# EasyEDA Pro project ProDoc_PCB6_2026-08-05.epro

# Schematic Schematic3
Assembly Variant: Basic; Board Name: PCB6; Create Date: 2026-03-05; Page Name: P1; Project Name: 电路原理图和PCB图; Schematic Name: Schematic3; Update Date: 2026-03-05; BladeWidth: 10; Company: 嘉立创EDA; Page Size: A4; RegionStart: 1; ShowBorder: 1; TitleBlock: 1; TitleBlockPosition: 3; Version: V1.0; XRegionCount: 6; YRegionCount: 4
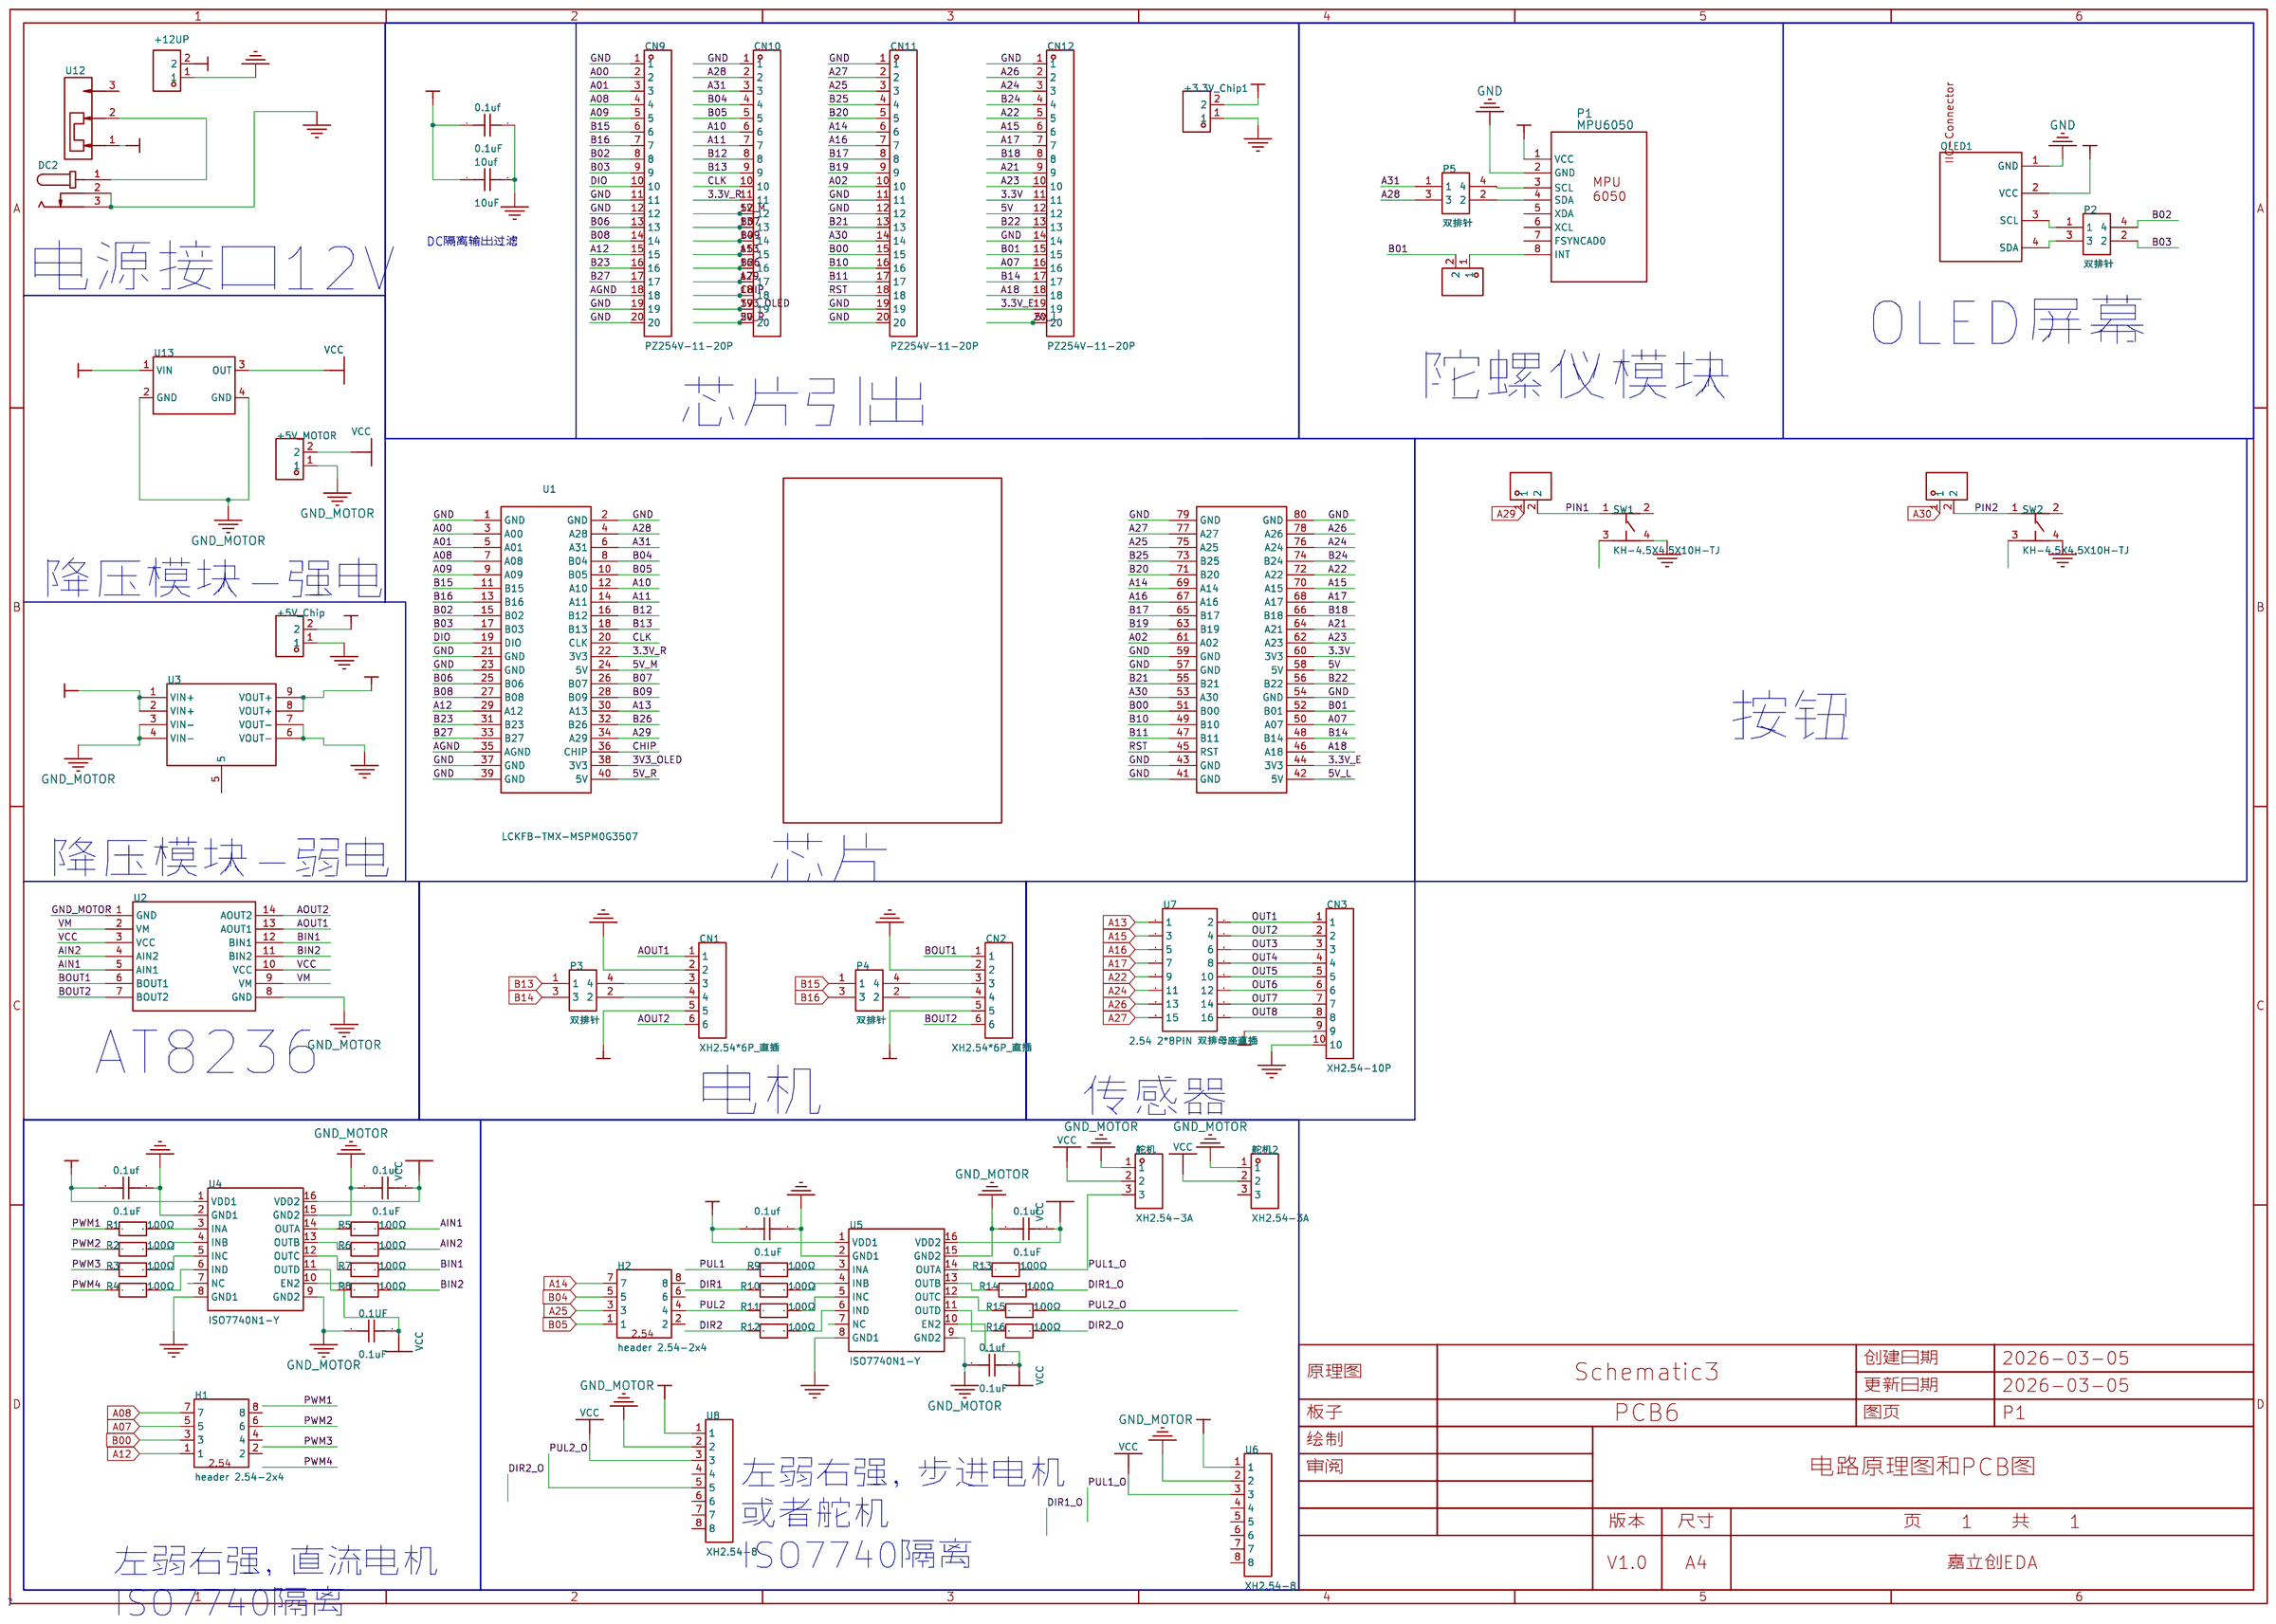
[diagram p0: schematic sheet]

## Parts
0.1uf  0.1uF  [C0805]
0.1UF  0.1uF  [C0805]
0.1uf#2  0.1uF  [C0805]
0.1uf#3  0.1uF  [C0805]
0.1uf#4  0.1uF  [C0805]
0.1uf#5  0.1uF  [C0805]
0.1uf#6  0.1uF  [C0805]
10uf  10uF  [C0805]
+3.3V_Chip1  -  [HDR-TH_2P-P2.54-V]
+5V_Chip  -  [HDR-TH_2P-P2.54-V]
+5V_MOTOR  -  [HDR-TH_2P-P2.54-V]
+12UP  -  [HDR-TH_2P-P2.54-V]
+12UP2  -  [HDR-TH_2P-P2.54-V]
CN1  XH2.54*6P_直插  [CONN-TH_XH2.54-6P]
CN2  XH2.54*6P_直插  [CONN-TH_XH2.54-6P]
CN3  XH2.54-10P  [CONN-TH_10P-P2.54_XH2.54-10P]
CN9  PZ254V-11-20P  [HDR-TH_20P-P2.54-V-M-4]
CN10  PZ254V-11-20P  [HDR-TH_20P-P2.54-V-M-4]
CN11  PZ254V-11-20P  [HDR-TH_20P-P2.54-V-M-4]
CN12  PZ254V-11-20P  [HDR-TH_20P-P2.54-V-M-4]
DC2  -  [DC-IN-TH_KH-DC-005-2.5]
H1  header 2.54-2x4  [header 2.54-2x4]
H2  header 2.54-2x4  [header 2.54-2x4]
INT  -  [HDR-TH_2P-P2.54-V]
OLED1  -  [0.96OLED_4P]
P1  MPU6050  [MPU6050]
P2  双排针  [2*2P 2.54mm]
P3  双排针  [2*2P 2.54mm]
P4  双排针  [2*2P 2.54mm]
P5  双排针  [2*2P 2.54mm]
R1  100Ω  [R0805]
R2  100Ω  [R0805]
R3  100Ω  [R0805]
R4  100Ω  [R0805]
R5  100Ω  [R0805]
R6  100Ω  [R0805]
R7  100Ω  [R0805]
R8  100Ω  [R0805]
R9  100Ω  [R0805]
R10  100Ω  [R0805]
R11  100Ω  [R0805]
R12  100Ω  [R0805]
R13  100Ω  [R0805]
R14  100Ω  [R0805]
R15  100Ω  [R0805]
R16  100Ω  [R0805]
SW1  KH-4.5X4.5X10H-TJ  [SW-TH_4P-L4.5-W4.5-P3.00-LS5.0]
SW2  KH-4.5X4.5X10H-TJ  [SW-TH_4P-L4.5-W4.5-P3.00-LS5.0]
SW3  -  [HDR-TH_2P-P2.54-V]
U1  LCKFB-TMX-MSPM0G3507  [COMM-TH_LCKFB-TMX-MSPM0G3507]
U2  -  [AT8236]
U3  -  [XC5015]
U4  ISO7740N1-Y  [SOIC-16_L9.9-W3.9-P1.27-LS6.0-BL-1]
U5  ISO7740N1-Y  [SOIC-16_L9.9-W3.9-P1.27-LS6.0-BL-1]
U6  XH2.54-8  [CONN-TH_8P-P2.54_XH2.54_C9900012080]
U7  2.54 2*8PIN 双排母座直插  [HDR-TH_16P-P2.54-V-F-R2-C8-S2.54-1]
U8  XH2.54-8  [CONN-TH_8P-P2.54_XH2.54_C9900012080]
U12  SS-12D10-G5  [SW-TH_SS-12D10-G050]
U13  -  [MP1584模块]
舵机  XH2.54-3A  [CONN-TH_3P-P2.50_HCTL_XH-3A-L]
舵机2  XH2.54-3A  [CONN-TH_3P-P2.50_HCTL_XH-3A-L]

## Library data of the parts
0.1uf 0.1UF 0.1uf#2-0.1uf#6 10uf = 0805X5R106K350NT: 容值:10uF;精度:±10%;额定电压:35V;温度系数:X5R;; LCSC Part Name: 10uF ±10% 35V; Supplier Part: C49326680; Manufacturer: AIDE(爱迪电容); Supplier Footprint: 0805; JLCPCB Part Class: Extended Part; Datasheet: https://item.szlcsc.com/datasheet/0805X5R106K350NT/51802510.html; Supplier: LCSC; Tolerance: ±10%; Voltage Rating: 35V; Temperature Coefficient: X5R
+3.3V_Chip1 +5V_Chip +5V_MOTOR +12UP +12UP2 INT SW3 = 排针2P: 2.54 1*2P 直排针 0.8u镀金 PBT RoHS,针长3*6mm; Supplier Part: C152154; Manufacturer: Nextron(台湾正凌); Manufacturer Part: Z-211-0211-0021-001; LCSC On Sale: 1; Supplier Footprint: Through Hole,P=2.54mm; JLCPCB Part Class: Extended Part; JLCPCB Stock Number: 5280; Datasheet: https://atta.szlcsc.com/upload/public/pdf/source/20171225/C152154_15141883746031203216.pdf; Supplier: LCSC; Number of Positions: 2; Connector Type: 排针; Number of Rows: 1; Mounting Type: 通孔; Contact Type: 公形引脚; Pitch: 0.100; Contact Material: 黄铜
CN1 CN2 = XH2.54*6P_直插: Supplier Part: C9900008614; Supplier Footprint: XH2.54_6P; JLCPCB Part Class: Extended Part; Supplier: LCSC
CN3 = XH2.54-10P: Supplier Part: C9900019295; Supplier Footprint: P=2.54; JLCPCB Part Class: Extended Part; Supplier: LCSC
CN9-CN12 = PZ254V-11-20P: LCSC Part Name: 排针2.54mm间距 单排 1x20P 直插 方针; Supplier Part: C22465880; Manufacturer: XFCN(兴飞); Supplier Footprint: 插件,P=2.54mm; JLCPCB Part Class: 扩展库; Datasheet: https://atta.szlcsc.com/upload/public/pdf/source/20240617/C325FF89D0FCE13B2A10BE2D3D7E6B84.pdf; Supplier: LCSC
DC2 = KH-DC-005-2.5: 连接器类型:DC电源插座;安装方式:弯插;触点内径:-;触点外径:6.4mm;额定电流:1A;额定电压:30V;工作温度范围:-25~+70;; LCSC Part Name: DC电源插座 外径:6.4mm; Supplier Part: C2847170; Manufacturer: kinghelm(金航标); Supplier Footprint: 插件; JLCPCB Part Class: Extended Part; Datasheet: https://atta.szlcsc.com/upload/public/pdf/source/20210716/C2847170_7F0110A0BEDEE81C68B76DF87AC8DA16.pdf; Supplier: LCSC; Connector Type: DC电源插座; Mounting Style: 弯插; Outside Contact Diameter: 6.4mm; Current Rating (Max): 1A; Voltage Rating (Max): 30V; Operating Temperature Range: -25~+70
H1 H2 = header 2.54-2x4
OLED1 = 0.96OLED_4P: LCSC Part Name: 0.96OLED_4P_MODULE_JX; Supplier Part: C9900004566; Manufacturer Part: 0.96OLED_4P_MODULE_JX; Supplier Footprint: THrough hole; JLCPCB Part Class: Extended Part; Supplier: LCSC
P1 = MPU6050
P2-P5 = 2*2P 2.54mm
R1-R16 = Y16245R00000F9W: 电阻类型:-;阻值:5Ω;精度:±1%;功率:200mW;工作电压:40V;温度系数:±0.2ppm/℃;; LCSC Part Name: 5Ω ±1% 200mW; Supplier Part: C1356687; Manufacturer: VISHAY(威世); Supplier Footprint: 0805; JLCPCB Part Class: Extended Part; Datasheet: https://item.szlcsc.com/datasheet/Y16245R00000F9W/1446974.html; Supplier: LCSC; Tolerance: ±1%; Power(Watts): 200mW; Voltage-Supply(Max): 40V; Temperature Coefficient: ±0.2ppm/℃; Operating Temperature: -55℃~+150℃
SW1 SW2 = KH-4.5X4.5X10H-TJ: 电路结构:单刀单掷;按钮形状:圆形按钮;安装方式:直插;开关长度:4.5mm;开关宽度:4.5mm;开关高度:10mm;带支架:不带支架;带灯:无;; LCSC Part Name: 4.5mm*4.5mm*10mm; Supplier Part: C6915243; Manufacturer: kinghelm(金航标); Supplier Footprint: 插件-4P,4.5x4.5mm; JLCPCB Part Class: Extended Part; Datasheet: https://item.szlcsc.com/datasheet/KH-4.5X4.5X10H-TJ/7879759.html; Supplier: LCSC; Circuit: 单刀单掷; Actuator Style: 圆形按钮; Mounting Type: 直插; Length: 4.5mm; Width: 4.5mm; Switch Height: 10mm; with Bracket: 不带支架; Actuator/Cap Color: 黑色; With Lamp: 无; Termination Style: PC引脚
U1 = LCKFB-TMX-MSPM0G3507: LCSC Part Name: 5件套 立创·天猛星MSPM0G3507开发板; Supplier Part: C42378531; Manufacturer: 立创开发板; Datasheet: https://atta.szlcsc.com/upload/public/pdf/source/20241209/800332349277522348D9357AB5109808.pdf; Supplier: LCSC
U2 = AT8236
U3 = XC5015隔离模块
U4 U5 = ISO7740N1-Y: 四通道数字隔离器,电容隔离，SOP16封装; LCSC Part Name: 四通道隔离器-窄体; Supplier Part: C53446591; Manufacturer: YLPTEC(易川); Supplier Footprint: SOIC-16; JLCPCB Part Class: Extended Part; Datasheet: https://item.szlcsc.com/datasheet/ISO7740N1-Y/56597971.html; Supplier: LCSC; Number of Forward Channels: 4; Number of Reverse Channels: 0; Data Rate(Max): 150Mbps; Default Output: 高电平; Isolation Voltage(Vrms): 3750; CMTI(kV/us): 200kV/us; Voltage - Supply(VCCA): 2.5V~5.5V; Voltage - Supply(VCCB): 2.5V~5.5V; Operating Temperature: -40℃~+125℃
U6 U8 = XH2.54-8: Supplier Part: C9900012080; JLCPCB Part Class: Extended Part; Supplier: LCSC
U7 = 2.54 2*8PIN 双排母座直插: Supplier Part: C9900000696; Supplier Footprint: TH-16_5.0X20.3X2.54P; JLCPCB Part Class: Extended Part; Supplier: LCSC
U12 = SS-12D10-G5: 电路结构:单刀双掷;安装方式:直插;开关颜色:黑色;滑钮形状:矩形柱状;引脚样式:PC引脚;开关长度:12.7mm;开关宽度:6.7mm;开关高度:11.3mm;; LCSC Part Name: 插件大电流拨动开关; Supplier Part: C2998777; Manufacturer: DEALON(德艺隆); Supplier Footprint: 插件; JLCPCB Part Class: Extended Part; Datasheet: https://atta.szlcsc.com/upload/public/pdf/source/20220428/E10CB334ACBAF32CF4AF8D87DA871CD3.pdf; Supplier: LCSC; Circuit: 单刀双掷; Mounting Style: 直插; Actuator Color: 黑色; Actuator Style: 矩形柱状; Pin Style: PC引脚; Switch Length: 12.7mm; Switch Width: 6.7mm; Switch Height: 11.3mm
U13 = MP1584模块: Pin Type: IN
舵机 舵机2 = XH2.54-3A: Supplier Part: C9900018379; JLCPCB Part Class: Extended Part; Supplier: LCSC

## Nets
3.3V: 0.1uf#3.1 0.1uf#4.1 CN3.9 CN12.11 U1.60(3V3) U4.1(VDD1) U5.1(VDD1)
3.3V_E: CN1.5 CN2.5 CN12.19 P1.1(VCC) U1.44(3V3)
3.3V_R: CN10.11 U1.22(3V3)
3V3_OLED: +3.3V_Chip1.2 CN10.19 OLED1.2(VCC) U1.38(3V3)
5V: 0.1uf#6.1 10uf.1 +5V_Chip.2 CN12.12 U1.58(5V) U3.8(VOUT+) U3.9(VOUT+)
5V_L: CN12.20 U1.42(5V)
5V_M: CN10.12 U1.24(5V)
5V_R: CN10.20 U1.40(5V)
AGND: CN9.18 U1.35(AGND)
GND: 0.1uf#3.2 0.1uf#4.2 0.1uf#6.2 10uf.2 +3.3V_Chip1.1 +5V_Chip.1 CN1.2 CN2.2 CN3.10 CN9.1 CN9.11 CN9.12 CN9.19 CN9.20 CN10.1 CN11.1 CN11.11 CN11.12 CN11.19 CN11.20 CN12.1 CN12.14 OLED1.1(GND) P1.2(GND) SW1.4 SW2.4 U1.1(GND) U1.2(GND) U1.21(GND) U1.23(GND) U1.37(GND) U1.39(GND) U1.41(GND) U1.43(GND) U1.54(GND) U1.57(GND) U1.59(GND) U1.79(GND) U1.80(GND) U3.6(VOUT-) U3.7(VOUT-) U4.2(GND1) U4.8(GND1) U5.2(GND1) U5.8(GND1)
GND_MOTOR: 0.1uf.1 0.1UF.1 0.1uf#2.1 0.1uf#5.1 +5V_MOTOR.1 +12UP.1 DC2.2 DC2.3 U2.1(GND) U2.8(GND) U3.3(VIN-) U3.4(VIN-) U4.9(GND2) U4.15(GND2) U5.9(GND2) U5.15(GND2) U6.2 U8.2 U13.2(GND) U13.4(GND) 舵机.1 舵机2.1
VCC: 0.1uf.2 0.1UF.2 0.1uf#2.2 0.1uf#5.2 +5V_MOTOR.2 U2.3(VCC) U2.10(VCC) U4.10(EN2) U4.16(VDD2) U5.10(EN2) U5.16(VDD2) U6.3 U8.3 U13.3(OUT) 舵机.2 舵机2.2
A00: CN9.2 U1.3(A00)
A01: CN9.3 U1.5(A01)
A02: CN11.10 U1.61(A02)
A07: CN12.16 H1.5 U1.50(A07)
A08: CN9.4 H1.7 U1.7(A08)
A09: CN9.5 U1.9(A09)
A10: CN10.6 U1.12(A10)
A11: CN10.7 U1.14(A11)
A12: CN9.15 H1.1 U1.29(A12)
A13: CN10.15 U1.30(A13) U7.1
A14: CN11.6 H2.7 U1.69(A14)
A15: CN12.6 U1.70(A15) U7.3
A16: CN11.7 U1.67(A16) U7.5
A17: CN12.7 U1.68(A17) U7.7
A18: CN12.18 U1.46(A18)
A21: CN12.9 U1.64(A21)
A22: CN12.5 U1.72(A22) U7.9
A23: CN12.10 U1.62(A23)
A24: CN12.3 U1.76(A24) U7.11
A25: CN11.3 H2.3 U1.75(A25)
A26: CN12.2 U1.78(A26) U7.13
A27: CN11.2 U1.77(A27) U7.15
A28: CN10.2 P5.3 U1.4(A28)
A29: CN10.17 SW3.1 U1.34(A29)
A30: +12UP2.1 CN11.14 U1.53(A30)
A31: CN10.3 P5.1 U1.6(A31)
AIN1: R5.2 U2.5(AIN1)
AIN2: R6.2 U2.4(AIN2)
AOUT1: CN1.1 U2.13(AOUT1)
AOUT2: CN1.6 U2.14(AOUT2)
B00: CN11.15 H1.3 U1.51(B00)
B01: CN12.15 INT.2 U1.52(B01)
B02: CN9.8 P2.4 U1.15(B02)
B03: CN9.9 P2.2 U1.17(B03)
B04: CN10.4 H2.5 U1.8(B04)
B05: CN10.5 H2.1 U1.10(B05)
B06: CN9.13 U1.25(B06)
B07: CN10.13 U1.26(B07)
B08: CN9.14 U1.27(B08)
B09: CN10.14 U1.28(B09)
B10: CN11.16 U1.49(B10)
B11: CN11.17 U1.47(B11)
B12: CN10.8 U1.16(B12)
B13: CN10.9 P3.1 U1.18(B13)
B14: CN12.17 P3.3 U1.48(B14)
B15: CN9.6 P4.1 U1.11(B15)
B16: CN9.7 P4.3 U1.13(B16)
B17: CN11.8 U1.65(B17)
B18: CN12.8 U1.66(B18)
B19: CN11.9 U1.63(B19)
B20: CN11.5 U1.71(B20)
B21: CN11.13 U1.55(B21)
B22: CN12.13 U1.56(B22)
B23: CN9.16 U1.31(B23)
B24: CN12.4 U1.74(B24)
B25: CN11.4 U1.73(B25)
B26: CN10.16 U1.32(B26)
B27: CN9.17 U1.33(B27)
BIN1: R7.2 U2.12(BIN1)
BIN2: R8.2 U2.11(BIN2)
BOUT1: CN2.1 U2.6(BOUT1)
BOUT2: CN2.6 U2.7(BOUT2)
CHIP: CN10.18 U1.36(CHIP)
CLK: CN10.10 U1.20(CLK)
DIO: CN9.10 U1.19(DIO)
DIR1: H2.6 R10.1
DIR1_O: R14.2 U6.6
DIR2: H2.2 R12.1
DIR2_O: R16.2 U8.6
OUT1: CN3.1 U7.2
OUT2: CN3.2 U7.4
OUT3: CN3.3 U7.6
OUT4: CN3.4 U7.8
OUT5: CN3.5 U7.10
OUT6: CN3.6 U7.12
OUT7: CN3.7 U7.14
OUT8: CN3.8 U7.16
PIN1: SW1.1 SW3.2
PIN2: +12UP2.2 SW2.1
PUL1: H2.8 R9.1
PUL1_O: R13.2 U6.5 舵机.3
PUL2: H2.4 R11.1
PUL2_O: R15.2 U8.5 舵机2.3
PWM1: H1.8 R1.1
PWM2: H1.6 R2.1
PWM3: H1.4 R3.1
PWM4: H1.2 R4.1
RST: CN11.18 U1.45(RST)
VM: +12UP.2 U2.2(VM) U2.9(VM) U3.1(VIN+) U3.2(VIN+) U6.1 U8.1 U12.1 U13.1(VIN)
$1N279: R1.2 U4.3(INA)
$1N280: R2.2 U4.4(INB)
$1N281: R3.2 U4.5(INC)
$1N282: R4.2 U4.6(IND)
$1N288: R5.1 U4.14(OUTA)
$1N289: R6.1 U4.13(OUTB)
$1N290: R7.1 U4.12(OUTC)
$1N291: R8.1 U4.11(OUTD)
$1N324: DC2.1 U12.2
$1N338: R16.1 U5.11(OUTD)
$1N339: R15.1 U5.12(OUTC)
$1N340: R14.1 U5.13(OUTB)
$1N341: R13.1 U5.14(OUTA)
$1N347: R12.2 U5.6(IND)
$1N348: R11.2 U5.5(INC)
$1N349: R10.2 U5.4(INB)
$1N350: R9.2 U5.3(INA)
$1N570: OLED1.3(SCL) P2.1
$1N571: OLED1.4(SDA) P2.3
$1N572: CN1.3 P3.4
$1N573: CN1.4 P3.2
$1N574: CN2.3 P4.4
$1N575: CN2.4 P4.2
$1N583: P1.3(SCL) P5.4
$1N584: P1.4(SDA) P5.2
$1N587: INT.1 P1.8(INT)

Not connected (* = marked no-connect by the designer): P1 5(XDA) 6(XCL) 7(FSYNCAD0); SW1 2 3; SW2 2 3; U3 5; U4 7(NC); U5 7(NC); U6 4 7 8; U8 4 7 8; U12 3

## Notes on the sheet
- DC隔离输出过滤
- 电源接口12V
- OLED屏幕
- 陀螺仪模块
- 芯片引出
- 降压模块-强电
- 按钮
- 降压模块-弱电
- 芯片
- AT8236
- 电机
- 传感器
- 左弱右强，步进电机
  或者舵机
  ISO7740隔离
- 左弱右强，直流电机
  ISO7740隔离

# Board PCB6
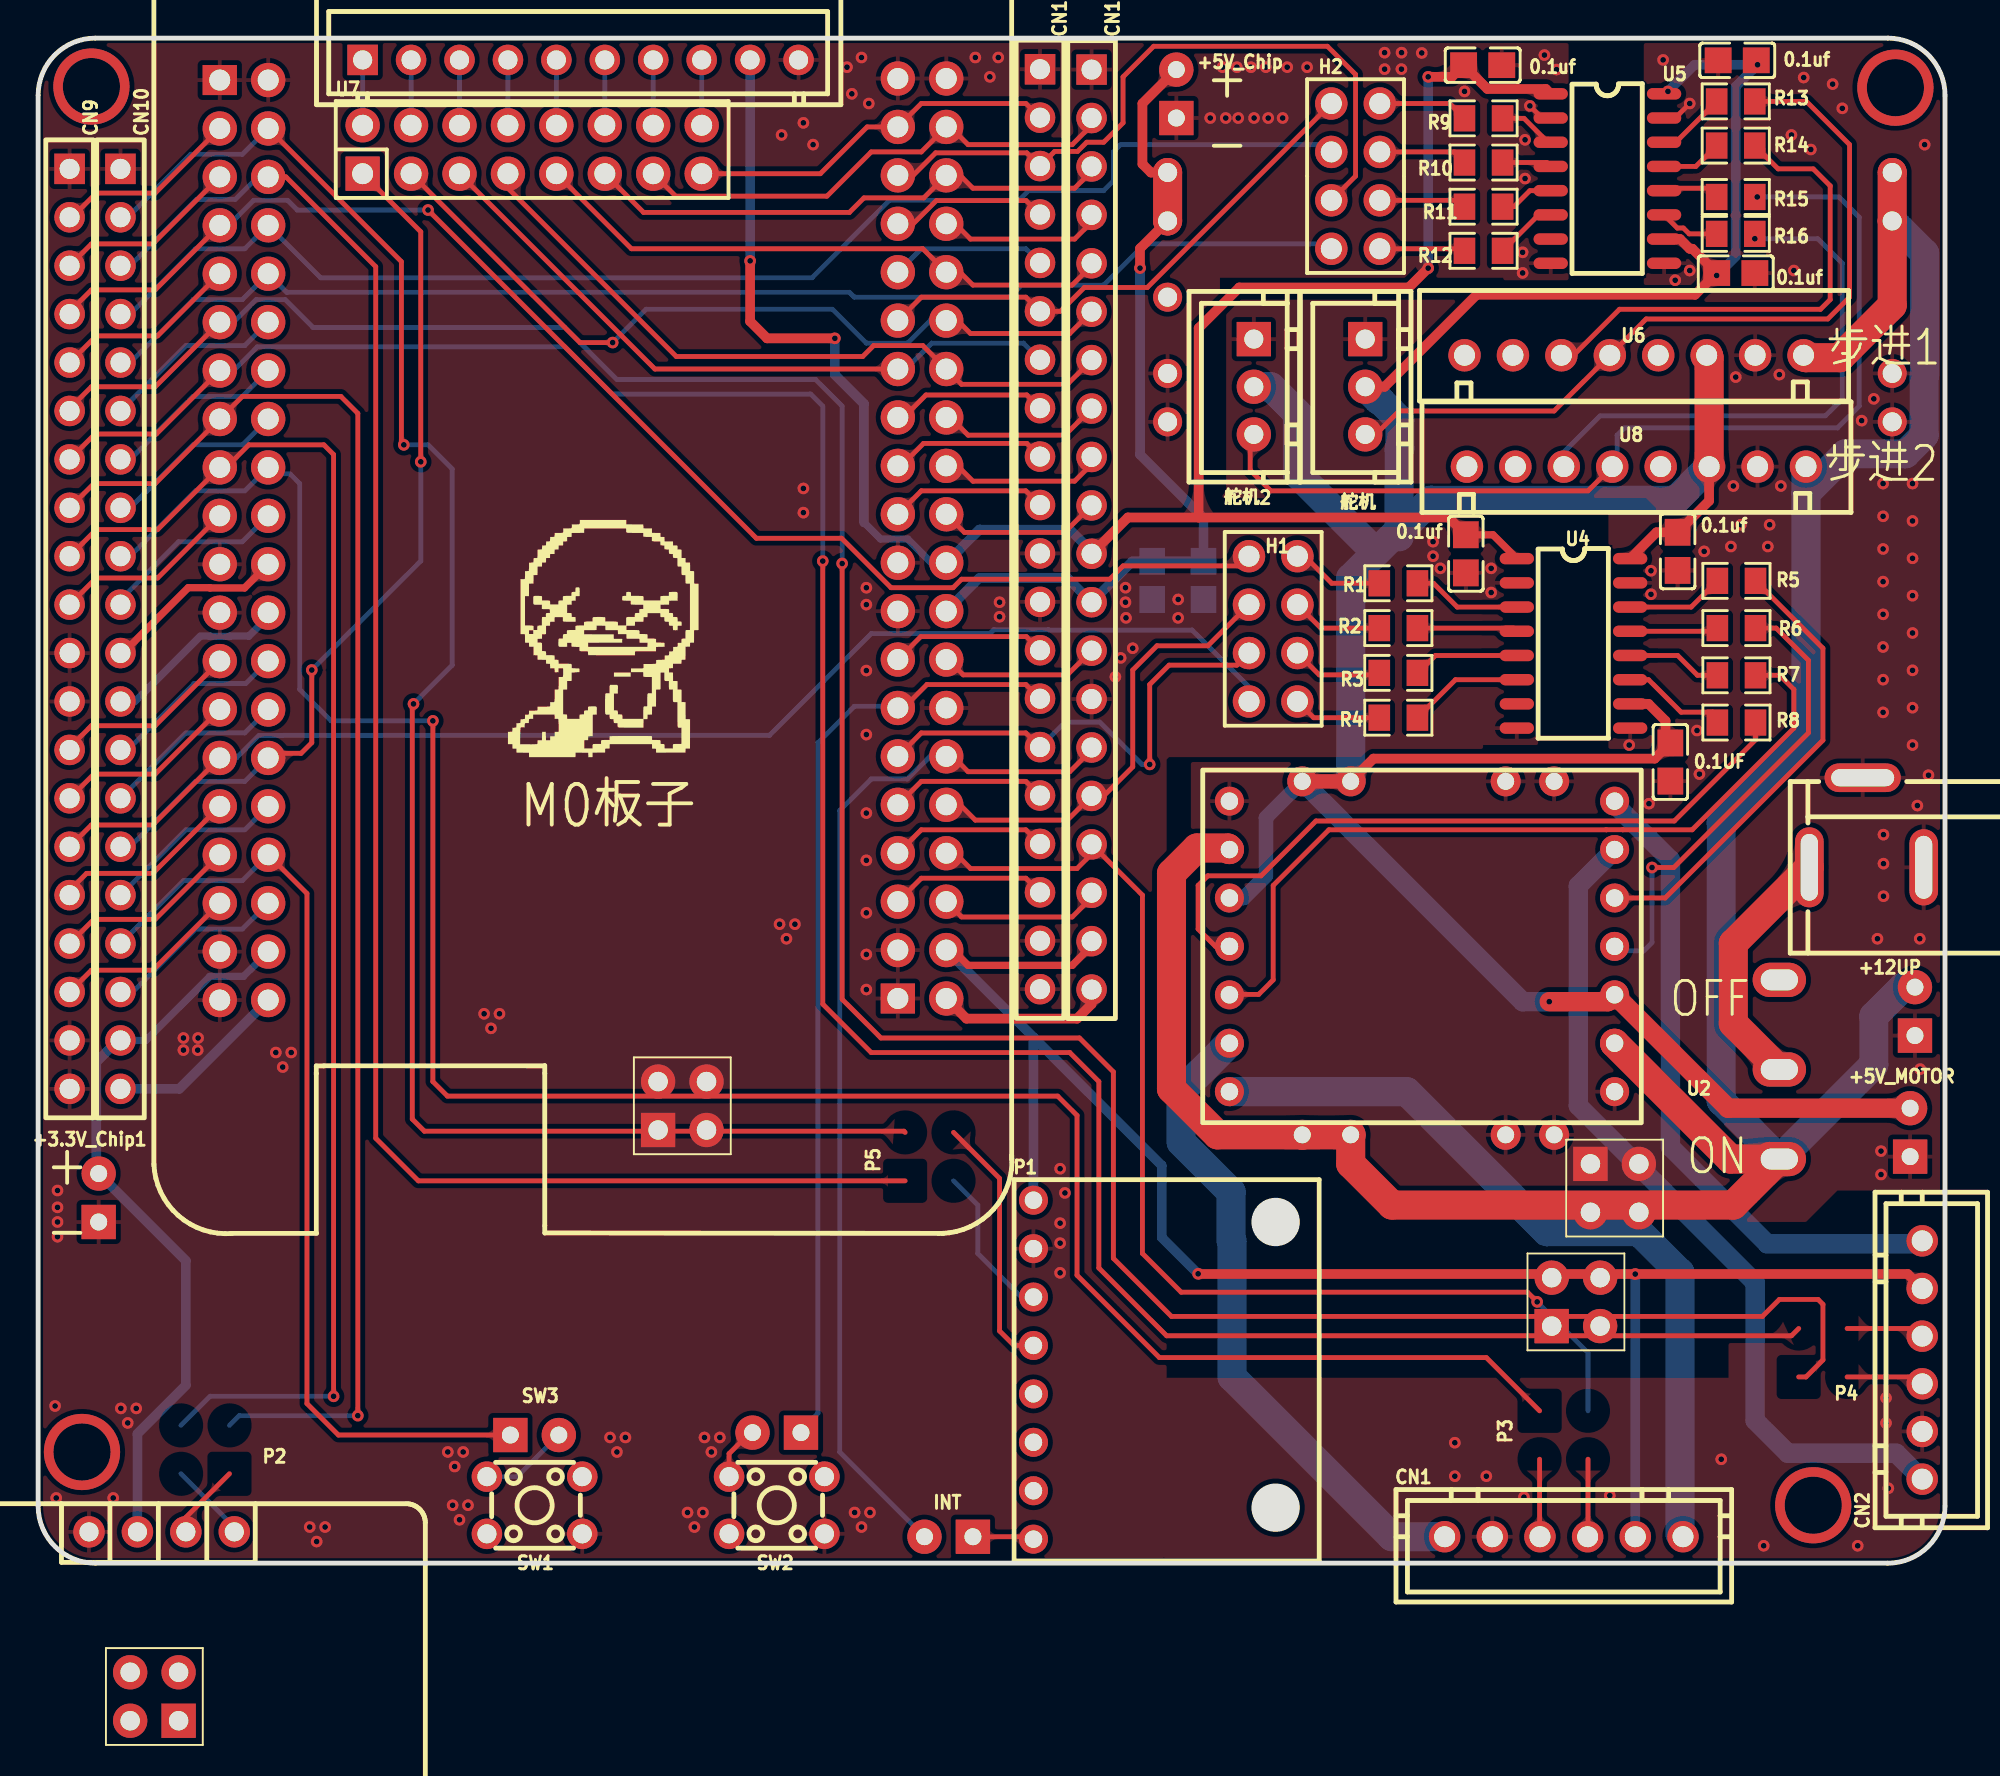
[diagram p1: board, top side]
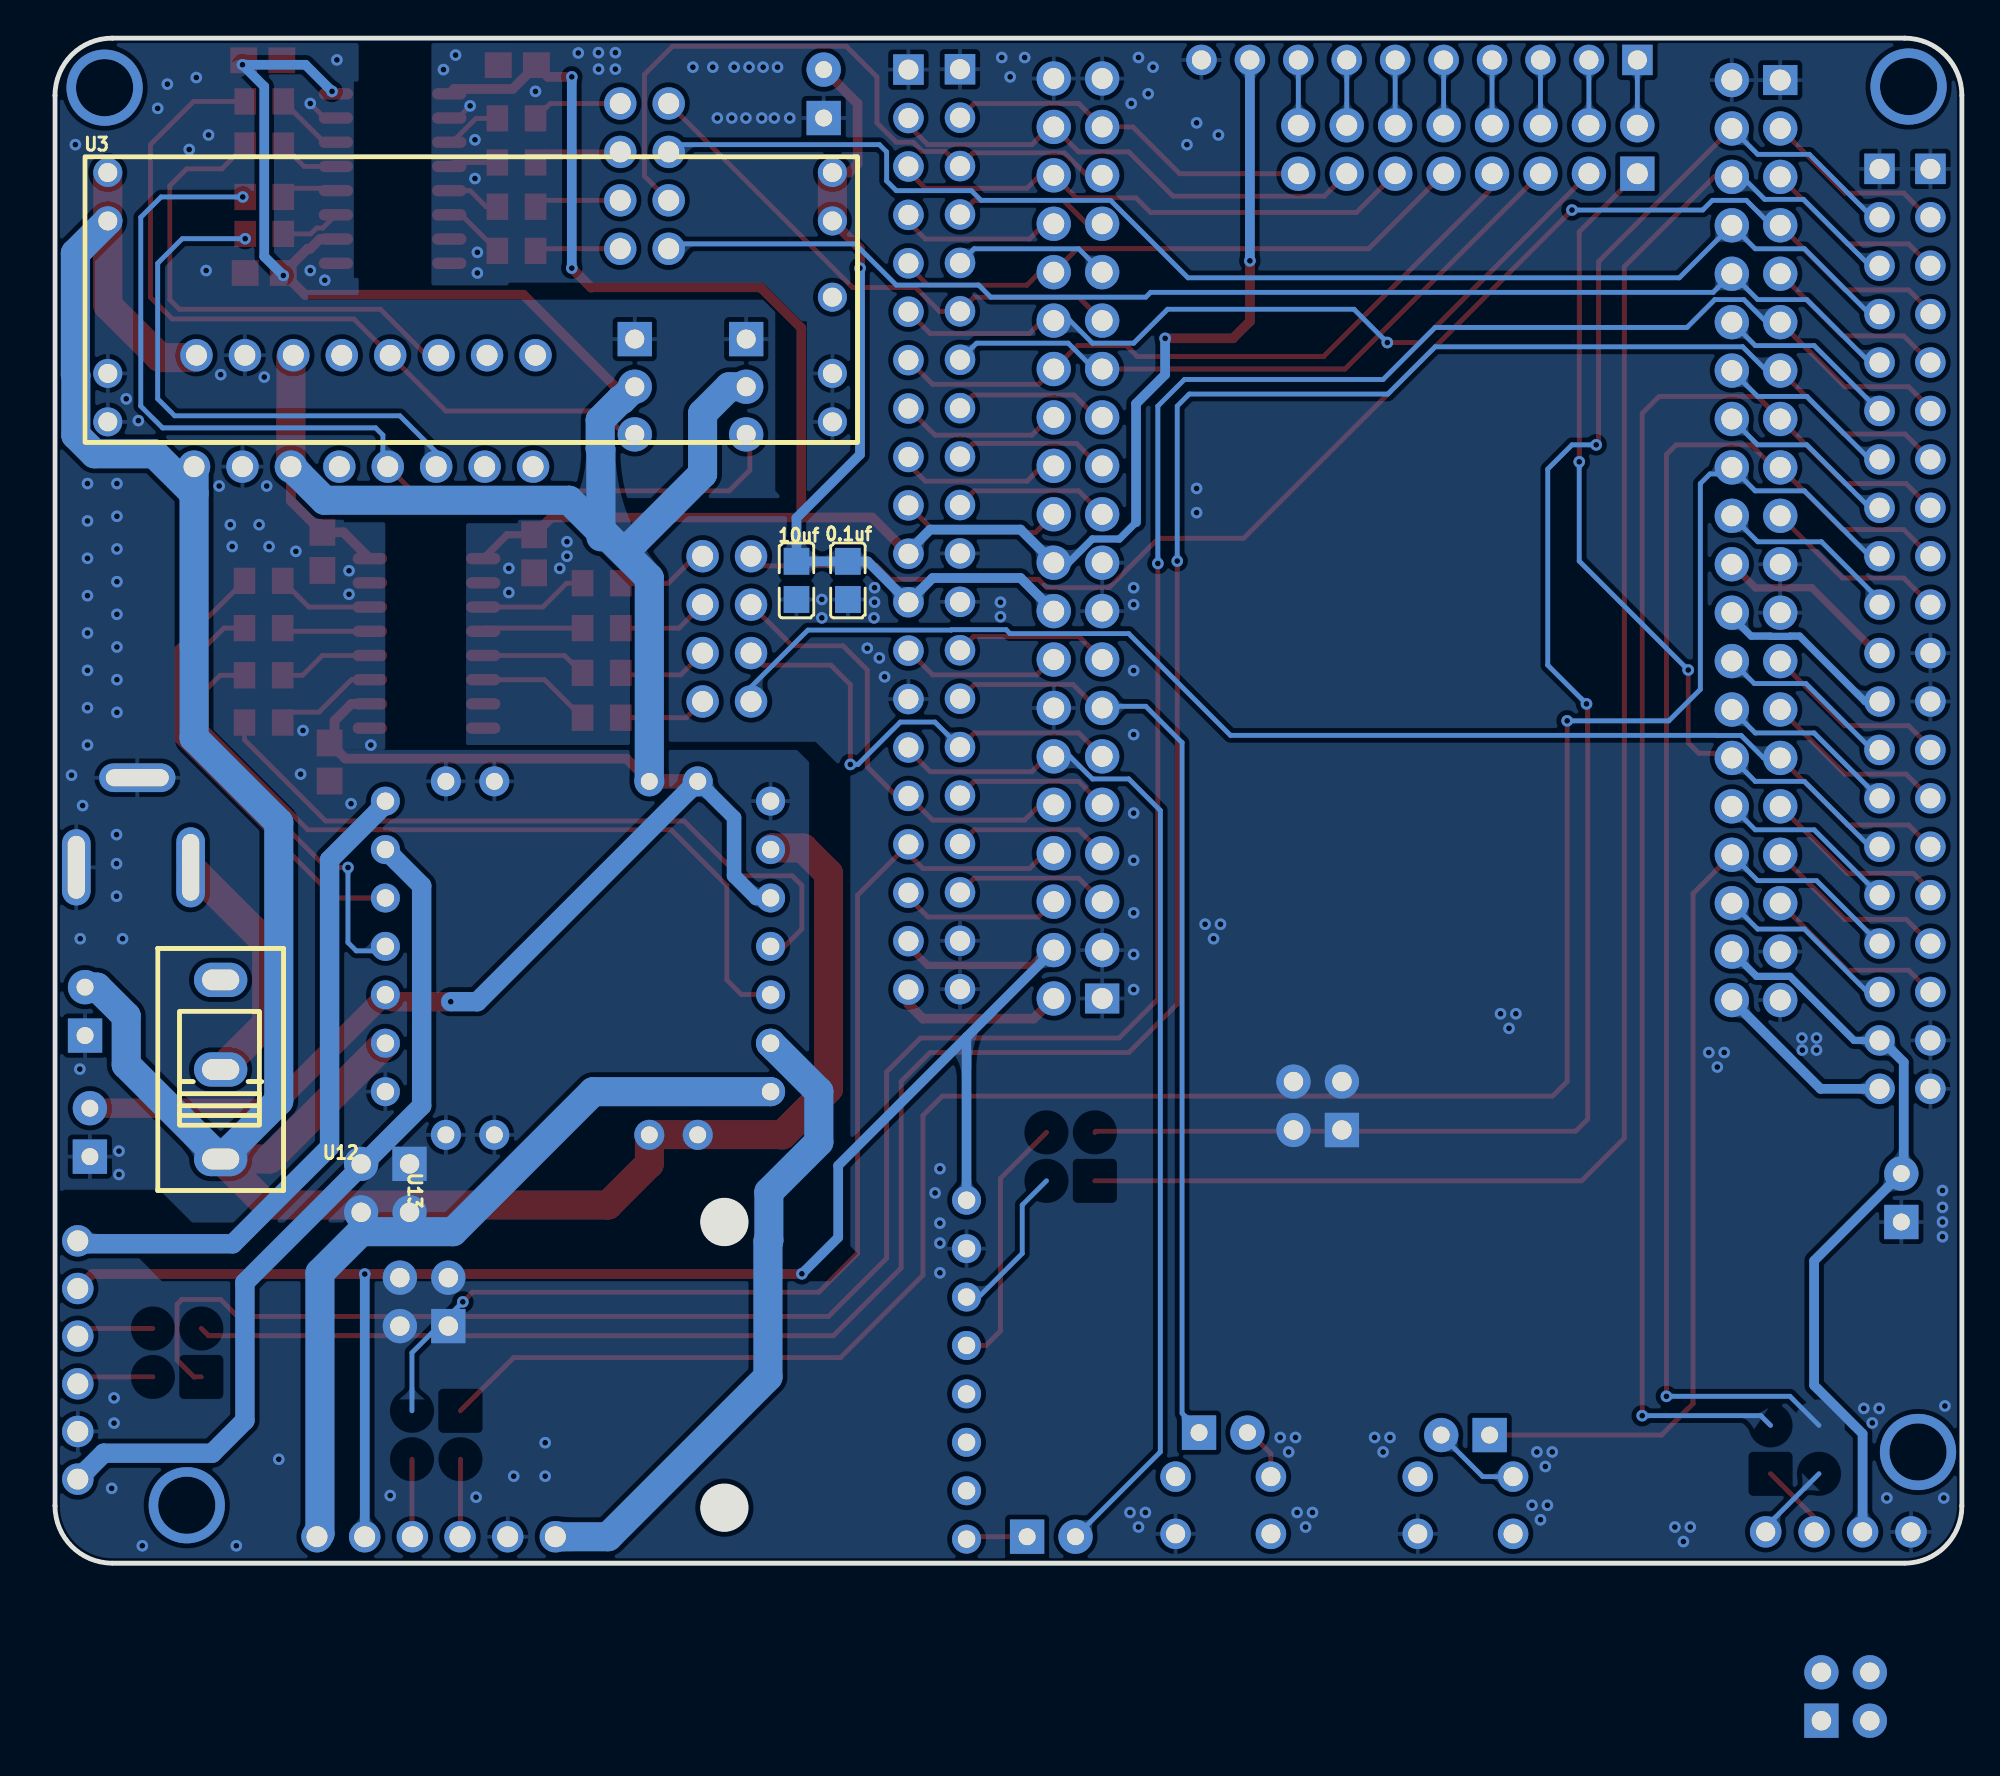
[diagram p2: board, bottom side, seen from below]

Outline 100 x 80 mm; copper layers: Top Layer, Bottom Layer. Coordinates in mm from the lower left corner of the outline.
Outline path: 0,77 0,3 arc(0.88,0.88) 3,0 97,0 arc(99.12,0.88) 100,3 100,77 arc(99.12,79.12) 97,80 3,80 arc(0.88,79.12) 0,77
Stack: Top Layer 0.035mm / Dielectric1 1.51mm FR4 er 4.5 / Bottom Layer 0.035mm

## Design rules (mm)
spacing copperThickness1oz (default): track to track 0.102, other pairs 0.152 to 0.3
spacing copperThickness2oz: track to track 0.203, other pairs 0.152 to 0.3
track width copperThickness1oz (default): min 0.127, default 0.254, max 2.54
track width copperThickness2oz: min 0.203, default 0.254, max 2.54
differential pair differentialPair (default): width min 0.127, default 0.254, max 2.54; gap min 0.152, default 0.152
net GND_MOTOR uses copperRegion
net GND uses copperRegion

## Placement (name value [footprint] x y rotation side)
0.1uf  0.1uF  [C0805]  89.1 78.84 0 top
0.1UF  0.1uF  [C0805]  85.6 42.03 90 top
0.1uf#2  0.1uF  [C0805]  75.75 78.58 0 top
0.1uf#3  0.1uF  [C0805]  85.98 53.08 90 top
0.1uf#4  0.1uF  [C0805]  74.87 52.95 270 top
0.1uf#5  0.1uF  [C0805]  89.03 67.68 180 top
0.1uf#6  0.1uF  [C0805]  58.42 51.55 270 bottom
10uf  10uF  [C0805]  61.11 51.55 270 bottom
+3.3V_Chip1  -  [HDR-TH_2P-P2.54-V]  3.17 19.17 90 top
+5V_Chip  -  [HDR-TH_2P-P2.54-V]  59.69 77.08 90 top
+5V_MOTOR  -  [HDR-TH_2P-P2.54-V]  98.17 22.6 90 top
+12UP  -  [HDR-TH_2P-P2.54-V]  98.43 28.95 90 top
+12UP2  -  [HDR-TH_2P-P2.54-V]  38.74 6.85 180 top
CN1  XH2.54*6P_直插  [CONN-TH_XH2.54-6P]  80.01 1.39 0 top
CN2  XH2.54*6P_直插  [CONN-TH_XH2.54-6P]  98.81 10.66 90 top
CN3  XH2.54-10P  [CONN-TH_10P-P2.54_XH2.54-10P]  28.45 78.86 0 top
CN9  PZ254V-11-20P  [HDR-TH_20P-P2.54-V-M-4]  1.65 49.01 270 top
CN10  PZ254V-11-20P  [HDR-TH_20P-P2.54-V-M-4]  4.32 49.01 270 top
CN11  PZ254V-11-20P  [HDR-TH_20P-P2.54-V-M-4]  52.54 54.24 270 top
CN12  PZ254V-11-20P  [HDR-TH_20P-P2.54-V-M-4]  55.25 54.22 270 top
DC2  -  [DC-IN-TH_KH-DC-005-2.5]  95.88 38.85 180 top
H1  -  [header 2.54-2x4]  63.5 45.2 0 top
H2  -  [header 2.54-2x4]  67.82 68.95 0 top
INT  -  [HDR-TH_2P-P2.54-V]  47.75 1.39 180 top
OLED1  -  [0.96OLED_4P]  6.48 1.64 0 top
P1  -  [MPU6050]  51.18 0.12 0 top
P2  双排针  [2*2P 2.54mm]  8.76 5.96 90 top
P3  双排针  [2*2P 2.54mm]  80.01 6.72 270 top
P4  双排针  [2*2P 2.54mm]  93.6 11.04 0 top
P5  双排针  [2*2P 2.54mm]  46.74 21.33 0 top
R1  100Ω  [R0805]  71.33 51.4 0 top
R2  100Ω  [R0805]  71.33 49.05 0 top
R3  100Ω  [R0805]  71.33 46.7 0 top
R4  100Ω  [R0805]  71.33 44.35 0 top
R5  100Ω  [R0805]  89.06 51.53 0 top
R6  100Ω  [R0805]  89.06 49.05 0 top
R7  100Ω  [R0805]  89.06 46.58 0 top
R8  100Ω  [R0805]  89.06 44.1 0 top
R9  100Ω  [R0805]  75.8 75.79 0 top
R10  100Ω  [R0805]  75.8 73.47 0 top
R11  100Ω  [R0805]  75.8 71.16 0 top
R12  100Ω  [R0805]  75.8 68.84 0 top
R13  100Ω  [R0805]  89.03 76.68 0 top
R14  100Ω  [R0805]  89.03 74.36 0 top
R15  100Ω  [R0805]  89.03 71.67 0 top
R16  100Ω  [R0805]  89.03 69.73 0 top
SW1  KH-4.5X4.5X10H-TJ  [SW-TH_4P-L4.5-W4.5-P3.00-LS5.0]  26.03 3.04 0 top
SW2  KH-4.5X4.5X10H-TJ  [SW-TH_4P-L4.5-W4.5-P3.00-LS5.0]  38.74 3.04 0 top
SW3  -  [HDR-TH_2P-P2.54-V]  26.03 6.72 0 top
U1  LCKFB-TMX-MSPM0G3507  [COMM-TH_LCKFB-TMX-MSPM0G3507]  28.57 53.71 0 top
U2  -  [AT8236]  84.07 23.1 180 top
U3  -  [XC5015]  78.23 66.41 180 bottom
U4  ISO7740N1-Y  [SOIC-16_L9.9-W3.9-P1.27-LS6.0-BL-1]  80.52 48.25 270 top
U5  ISO7740N1-Y  [SOIC-16_L9.9-W3.9-P1.27-LS6.0-BL-1]  82.3 72.63 270 top
U6  XH2.54-8  [CONN-TH_8P-P2.54_XH2.54_C9900012080]  83.69 63.36 180 top
U7  2.54 2*8PIN 双排母座直插  [HDR-TH_16P-P2.54-V-F-R2-C8-S2.54-1]  25.91 74.16 0 top
U8  XH2.54-8  [CONN-TH_8P-P2.54_XH2.54_C9900012080]  83.82 57.52 180 top
U12  SS-12D10-G5  [SW-TH_SS-12D10-G050]  91.31 25.9 90 bottom
U13  -  [MP1584模块]  72.9 31.74 90 bottom
舵机  XH2.54-3A  [CONN-TH_3P-P2.50_HCTL_XH-3A-L]  69.6 61.71 90 top
舵机2  XH2.54-3A  [CONN-TH_3P-P2.50_HCTL_XH-3A-L]  63.75 61.71 90 top

## Footprints (pads in the part's own frame, mm; a bottom-side part is the same pattern mirrored in y, then rotated)
0.96OLED_4P
  round 1.651 hole 1.001: 1(-3.81,0) 2(-1.27,0.003) 3(1.27,0.003) 4(3.81,0.003)
2*2P 2.54mm
  rect 1.8x1.8 hole 1.02: 1(-14.224,1.397)
  round 1.8 hole 1.02: 2(-11.684,3.937) 3(-14.224,3.937) 4(-11.684,1.397)
AT8236
  round 1.524 hole 0.914: 1(1.4,-1.63) 2(1.4,-4.17) 3(1.4,-6.71) 4(1.4,-9.25) 5(1.4,-11.79) 6(1.4,-14.33) 7(1.4,-16.87) 8(21.6,-16.87) 9(21.6,-14.33) 10(21.6,-11.79) 11(21.6,-9.25) 12(21.6,-6.71) 13(21.6,-4.17) 14(21.6,-1.63)
C0805
  rect 1.41x1.35 smd: 1(-1,0) 2(1,0)
COMM-TH_LCKFB-TMX-MSPM0G3507
  rect 1.8x1.575 hole 1.1: 1(-19.05,24.09) 41(16.51,-24.09)
  round 1.8 hole 1.1: 2(-16.51,24.09) 3(-19.05,21.549) 4(-16.51,21.549) 5(-19.05,19.009) 6(-16.51,19.009) 7(-19.05,16.47) 8(-16.51,16.47) 9(-19.05,13.93) 10(-16.51,13.93) 11(-19.05,11.389) 12(-16.51,11.389) 13(-19.05,8.85) 14(-16.51,8.85) 15(-19.05,6.309) 16(-16.51,6.309) 17(-19.05,3.769) 18(-16.51,3.769) 19(-19.05,1.23) 20(-16.51,1.23) 21(-19.05,-1.31) 22(-16.51,-1.31) 23(-19.05,-3.85) 24(-16.51,-3.85) 25(-19.05,-6.391) 26(-16.51,-6.391) 27(-19.05,-8.931) 28(-16.51,-8.931) 29(-19.05,-11.47) 30(-16.51,-11.47) 31(-19.05,-14.011) 32(-16.51,-14.011) 33(-19.05,-16.55) 34(-16.51,-16.55) 35(-19.05,-19.09) 36(-16.51,-19.09) 37(-19.05,-21.631) 38(-16.51,-21.631) 39(-19.05,-24.171) 40(-16.51,-24.171) 42(19.05,-24.09) 43(16.51,-21.549) 44(19.05,-21.549) 45(16.51,-19.009) 46(19.05,-19.009) 47(16.51,-16.47) 48(19.05,-16.47) 49(16.51,-13.93) 50(19.05,-13.93) 51(16.51,-11.389) 52(19.05,-11.389) 53(16.51,-8.85) 54(19.05,-8.85) 55(16.51,-6.309) 56(19.05,-6.309) 57(16.51,-3.769) 58(19.05,-3.769) 59(16.51,-1.23) 60(19.05,-1.23) 61(16.51,1.31) 62(19.05,1.31) 63(16.51,3.85) 64(19.05,3.85) 65(16.51,6.391) 66(19.05,6.391) 67(16.51,8.931) 68(19.05,8.931) 69(16.51,11.47) 70(19.05,11.47) 71(16.51,14.011) 72(19.05,14.011) 73(16.51,16.55) 74(19.05,16.55) 75(16.51,19.09) 76(19.05,19.09) 77(16.51,21.631) 78(19.05,21.631) 79(16.51,24.171) 80(19.05,24.171)
CONN-TH_3P-P2.50_HCTL_XH-3A-L
  rect 1.8x1.8 hole 1: 1(2.5,0)
  round 1.8 hole 1: 2(0,0) 3(-2.5,0)
CONN-TH_8P-P2.54_XH2.54_C9900012080
  round 1.7 hole 1.1: 1(-8.89,0) 2(-6.35,0) 3(-3.81,0) 4(-1.27,0) 5(1.27,0) 6(3.81,0) 7(6.35,0) 8(8.89,0)
CONN-TH_10P-P2.54_XH2.54-10P
  rect 1.6x1.6 hole 1: 1(-11.43,0.001)
  round 1.6 hole 1: 2(-8.89,-0.001) 3(-6.35,-0.001) 4(-3.81,-0.001) 5(-1.27,-0.001) 6(1.27,-0.001) 7(3.81,-0.001) 8(6.35,-0.001) 9(8.89,-0.001) 10(11.43,-0.001)
CONN-TH_XH2.54-6P
  round 1.65 hole 1.1: 1(-6.25,0) 2(-3.75,0) 3(-1.25,0) 4(1.25,0) 5(3.75,0) 6(6.25,0)
DC-IN-TH_KH-DC-005-2.5
  oval 1.501x4.201 hole 0.899x3.5: 1(2.999,2.349)
  oval 1.501x4 hole 0.899x3.3: 2(-2.999,2.349)
  oval 4x1.501 hole 3.3x0.899: 3(0.201,-2.349)
HDR-TH_2P-P2.54-V
  rect 1.801x1.801 hole 0.889: 1(-1.27,0)
  round 1.801 hole 0.889: 2(1.27,0)
HDR-TH_16P-P2.54-V-F-R2-C8-S2.54-1
  rect 1.8x1.8 hole 1.1: 1(-8.89,-1.27)
  round 1.8 hole 1.1: 2(-8.89,1.27) 3(-6.35,-1.27) 4(-6.35,1.27) 5(-3.81,-1.27) 6(-3.81,1.27) 7(-1.27,-1.27) 8(-1.27,1.27) 9(1.27,-1.27) 10(1.27,1.27) 11(3.81,-1.27) 12(3.81,1.27) 13(6.35,-1.27) 14(6.35,1.27) 15(8.89,-1.27) 16(8.89,1.27)
HDR-TH_20P-P2.54-V-M-4
  rect 1.6x1.6 hole 1.05: 1(-24.13,0)
  round 1.6 hole 1.05: 2(-21.59,0) 3(-19.05,0) 4(-16.51,0) 5(-13.97,0) 6(-11.43,0) 7(-8.89,0) 8(-6.35,0) 9(-3.81,0) 10(-1.27,0) 11(1.27,0) 12(3.81,0) 13(6.35,0) 14(8.89,0) 15(11.43,0) 16(13.97,0) 17(16.51,0) 18(19.05,0) 19(21.59,0) 20(24.13,0)
header 2.54-2x4
  round 1.7 hole 1.1: 1(0,0) 2(2.54,0) 3(0,2.54) 4(2.54,2.54) 5(0,5.08) 6(2.54,5.08) 7(0,7.62) 8(2.54,7.62)
MP1584模块
  round 1.575 hole 0.889: 1(-9.271,-6.604) 1(-9.271,-4.064) 2(-9.271,4.064) 2(-9.271,6.604) 3(9.271,-6.604) 3(9.271,-4.064) 4(9.271,4.064) 4(9.271,6.604)
MPU6050
  round 1.524 hole 0.914: 1(1.016,18.923) 2(1.016,16.383) 3(1.016,13.843) 4(1.016,11.303) 5(1.016,8.763) 6(1.016,6.223) 7(1.016,3.683) 8(1.016,1.143)
R0805
  rect 1.133x1.377 smd: 1(-1,0) 2(1,0)
SOIC-16_L9.9-W3.9-P1.27-LS6.0-BL-1
  oval 0.6x1.8 smd: 1(-4.445,-2.972) 2(-3.175,-2.972) 3(-1.905,-2.972) 4(-0.635,-2.972) 5(0.635,-2.972) 6(1.905,-2.972) 7(3.175,-2.972) 8(4.445,-2.972) 9(4.445,2.972) 10(3.175,2.972) 11(1.905,2.972) 12(0.635,2.972) 13(-0.635,2.972) 14(-1.905,2.972) 15(-3.175,2.972) 16(-4.445,2.972)
SW-TH_4P-L4.5-W4.5-P3.00-LS5.0
  round 1.6 hole 1: 1(-2.5,1.5) 2(2.5,1.5) 3(-2.5,-1.5) 4(2.5,-1.5)
SW-TH_SS-12D10-G050
  oval 1.8x2.8 hole 1.1x1.95: 1(-4.7,0) 2(0,0) 3(4.7,0)
XC5015
  round 1.524 hole 1: 1(-19,6.54) 2(-19,4) 3(-19,-4) 4(-19,-6.54) 5(19,0) 6(19,-4) 7(19,-6.54) 8(19,4) 9(19,6.54)

## Nets
As in the schematic, except:
3.3V: 0.1uf#2.1 0.1uf#4.1 CN3.9 CN12.11 U1.60 U4.1 U5.1
GND: 0.1uf#2.2 0.1uf#4.2 0.1uf#6.2 10uf.2 +3.3V_Chip1.1 +5V_Chip.1 CN1.2 CN2.2 CN3.10 CN9.1 CN9.11 CN9.12 CN9.19 CN9.20 CN10.1 CN11.1 CN11.11 CN11.12 CN11.19 CN11.20 CN12.1 CN12.14 OLED1.1 P1.2 SW1.4 SW2.4 U1.1 U1.2 U1.21 U1.23 U1.37 U1.39 U1.41 U1.43 U1.54 U1.57 U1.59 U1.79 U1.80 U3.6 U3.7 U4.2 U4.8 U5.2 U5.8
GND_MOTOR: 0.1uf.1 0.1UF.1 0.1uf#3.1 0.1uf#5.1 +5V_MOTOR.1 +12UP.1 DC2.2 DC2.3 U2.1 U2.8 U3.3 U3.4 U4.9 U4.15 U5.9 U5.15 U6.2 U8.2 U13.2 U13.4 舵机.1 舵机2.1
VCC: 0.1uf.2 0.1UF.2 0.1uf#3.2 0.1uf#5.2 +5V_MOTOR.2 U2.3 U2.10 U4.10 U4.16 U5.10 U5.16 U6.3 U8.3 U13.3 舵机.2 舵机2.2

Pads without a net: P1 5 6 7; SW1 2; SW2 2; U3 5; U6 4 7 8; U8 4 7 8; U12 3

## Via types
v1: diameter 4, hole 3, Top Layer to Bottom Layer, 4 vias
v2: diameter 0.61, hole 0.305, Top Layer to Bottom Layer, 202 vias

## Routing (per net, layer and track width the routed paths; a pad name or vN(x,y) marks a point on that pad's centre or on a via; arc(x,y) is an arc through that point)
3.3V: length 107.5
  Top Layer w0.381: 0.1uf#4.1 76.29,53.95 U4.1
  Top Layer w0.508: CN12.11 57.15,54.85 60.86,54.85 ; v2(37.34,68.32) 37.34,65.14 38.23,64.25 v2(41.78,64.25) ; 0.1uf#4.1 73.97,54.85 60.86,54.85 ; 60.86,54.85 60.86,64.79 62.99,66.92 71.88,66.92 v2(72.9,67.94) ; v2(72.9,77.97) 74.14,77.97 0.1uf#2.1 76,77.33 79.07,77.33 U5.1
  Bottom Layer w0.381: 43.31,54.6 44.18,53.72 45.6,53.72 46.84,52.48 U1.60
  Bottom Layer w0.508: U1.60 49.36,54.22 54.1,54.22 55.25,53.08 CN12.11 ; v2(41.78,64.25) 41.78,62.35 43.31,60.82 43.31,54.6 ; CN3.9 v2(37.34,68.32) ; v2(72.9,67.94) v2(72.9,77.97)
3.3V_E: length 91.7
  Top Layer w0.381: CN12.19 55.25,32.38 54.23,31.36 48.77,31.36 47.97,32.16 U1.44
  Top Layer w0.508: v2(60.83,15.18) 60.85,15.17 v2(83.76,15.17) 98.05,15.17 CN2.5
  Bottom Layer w0.508: CN1.5 83.76,1.39 v2(83.76,15.17) ; U1.44 52.2,27.59 ; 52.2,27.59 58.93,20.86 58.93,17.08 v2(60.83,15.18) ; 52.2,27.59 P1.1
3.3V_R: length 9.7
  Top Layer w0.381: CN10.11 4.44,47.74 7.87,51.17 9,51.17 9.01,51.16 10.82,51.16 U1.22
3V3_OLED: length 39.1
  Bottom Layer w0.381: CN10.19 5.65,27.42 9.01,30.78 10.77,30.78 U1.38
  Bottom Layer w0.508: CN10.19 4.19,27.42 3.05,26.28 3.05,20.56 +3.3V_Chip1.2 7.75,15.87 7.75,9.33 5.21,6.79 OLED1.2
5V: length 45.2
  Top Layer w0.508: U3.9 58.36,72.95 57.91,73.4 57.91,76.57 +5V_Chip.2 ; v2(57.78,67.94) 57.78,68.96 U3.8
  Top Layer w1.524: U3.8 U3.9
  Bottom Layer w0.508: U1.58 49.36,51.68 53.97,51.68 CN12.12 57.39,52.55 0.1uf#6.1 10uf.1 61.11,54.83 57.78,58.16 v2(57.78,67.94)
5V_L: length 9.1
  Top Layer w0.508: CN12.20 55.25,29.33 54.48,28.56 48.68,28.56 U1.42
5V_M: length 9.8
  Bottom Layer w0.381: CN10.12 5.08,45.2 8.51,48.63 9,48.63 9.01,48.62 10.04,48.62 10.05,48.63 11.05,48.63 12.06,49.65 U1.24
5V_R: length 9.7
  Bottom Layer w0.508: CN10.20 7.41,24.88 U1.40
AGND: length 9.8
  Top Layer w0.254: CN9.18 2.79,31.11 6.01,31.11 U1.35
GND: length 1.4
  Top Layer w0.254: v2(78.23,76.44) 78.87,75.81 U5.2
  vias: v2(0.89,8.25) v2(0.95,3.42) v2(1.02,19.55) v2(1.02,18.66) v2(1.02,17.9) v2(1.02,17.12) v2(3.94,3.42) v2(4.34,8.12) v2(4.7,7.36) v2(5.14,8.12) v2(7.62,27.55) v2(7.62,26.91) v2(8.39,27.55) v2(8.37,26.91) v2(12.47,26.79) v2(12.83,26.03) v2(13.27,26.79) v2(14.24,1.9) v2(14.61,1.13) v2(15.05,1.9) v2(21.48,5.83) v2(21.74,3.04) v2(21.84,5.07) v2(22.1,2.28) v2(22.29,5.83) v2(22.54,3.04) v2(23.39,28.82) v2(23.75,28.06) v2(24.19,28.82) v2(29.99,6.59) v2(30.35,5.83) v2(30.8,6.59) v2(34.06,2.66) v2(34.42,1.9) v2(34.94,6.59) v2(34.86,2.66) v2(35.31,5.83) v2(35.75,6.59) v2(38.88,33.52) v2(38.99,74.92) v2(39.24,32.76) v2(39.69,33.52) v2(40.13,75.56) v2(40.13,56.38) v2(40.13,55.11) v2(40.64,74.41) v2(42.42,78.48) v2(42.67,77.08) v2(42.82,2.66) v2(43.18,78.98) v2(43.18,1.9) v2(43.43,51.17) v2(43.43,50.28) v2(43.43,46.82) v2(43.43,43.47) v2(43.43,39.35) v2(43.43,36.87) v2(43.43,34.11) v2(43.43,31.93) v2(43.43,30.09) v2(43.56,76.57) v2(43.62,2.66) v2(49.15,78.98) v2(49.91,77.97) v2(50.35,78.98) v2(50.42,50.41) v2(50.42,49.65) v2(53.59,20.69) v2(53.59,17.84) v2(53.59,16.79) v2(53.59,15.23) v2(53.85,19.42) v2(56.5,46.49) v2(56.77,47.49) v2(57.02,51.17) v2(57.02,50.41) v2(57.05,49.59) v2(57.4,48) v2(59.79,50.56) v2(59.79,49.59) v2(61.47,75.81) v2(62.11,78.48) v2(62.28,75.81) v2(62.87,78.48) v2(62.94,75.81) v2(63.6,78.48) v2(63.77,75.81) v2(64.38,78.48) v2(64.51,75.81) v2(65.27,75.81) v2(65.5,78.48) v2(66.55,78.48) v2(70.61,79.24) v2(70.61,78.37) v2(71.5,79.24) v2(71.5,78.37) v2(72.56,79.22) v2(73.15,53.58) v2(73.15,52.82) v2(73.53,52.19) v2(74.29,6.32) v2(74.29,4.56) v2(74.8,77.21) v2(75.95,4.56) v2(76.2,52.19) v2(76.2,50.92) v2(77.85,68.76) v2(77.85,67.68) v2(77.92,3.46) v2(77.98,74.67) v2(77.98,72.63) v2(78.99,79.11) v2(79.63,78.35) v2(82.42,3.55) v2(88.26,5.45) v2(90.49,0.91) v2(95.42,0.91) v2(96.91,8.67) v2(96.91,7.35) v2(97.03,3.93)
GND_MOTOR: length 1.7
  Top Layer w0.254: v2(86.61,76.57) 85.85,75.81 U5.15
  vias: v2(83.44,42.92) v2(84.48,39.84) v2(84.58,52.06) v2(84.58,50.83) v2(85.22,78.86) v2(85.85,67.3) v2(86.61,67.81) v2(87,43.68) v2(87.12,41.39) v2(87.37,53.08) v2(88.77,53.33) v2(88.9,56.5) v2(89.03,62.22) v2(89.3,54.47) v2(90.71,53.33) v2(90.81,54.47) v2(91.31,62.35) v2(91.39,56.5) v2(91.95,74.92) v2(92.07,67.81) v2(92.59,77.93) v2(92.96,74.16) v2(94.11,77.59) v2(94.62,76.32) v2(95.63,59.93) v2(96.27,61.08) v2(96.46,32.76) v2(96.65,21.62) v2(96.65,20.39) v2(96.75,56.63) v2(96.75,54.92) v2(96.75,53.2) v2(96.75,51.49) v2(96.75,49.77) v2(96.75,48.06) v2(96.75,46.34) v2(96.75,44.63) v2(96.77,38.22) v2(96.77,36.69) v2(96.77,34.99) v2(98.3,56.63) v2(98.3,54.67) v2(98.3,52.71) v2(98.3,50.75) v2(98.3,48.79) v2(98.3,46.83) v2(98.3,44.88) v2(98.3,42.92) v2(98.55,39.74) v2(98.68,32.76) v2(98.7,25.92) v2(98.93,74.41) v2(99.13,41.33)
VCC: length 177.8
  Top Layer w0.254: v2(90.17,78.6) 90.17,78.77 0.1uf.2
  Top Layer w0.508: U4.16 84.87,54.08 0.1uf#3.2 87.63,55.73 U8.3 ; 舵机.2 70.61,61.71 75.44,66.54 86.89,66.54 0.1uf#5.2 86.75,68.95 86.61,68.95 86.11,69.46 U5.10 ; U13.3 70.03,42.2 84.78,42.2 0.1UF.2 85.34,43.28 85.34,44.19 84.46,45.08 U4.10
  Top Layer w0.762: U13.3 U13.3
  Top Layer w1.016: +5V_MOTOR.2 88.62,23.87 U2.3 82.31,29.45 v2(79.25,29.45)
  Top Layer w1.524: U6.3 87.63,63.24 U8.3
  Bottom Layer w0.508: v2(88.03,67.55) 89.03,68.55 89.03,77.46 v2(90.17,78.6) 86.87,78.6 v2(85.47,77.21)
  Bottom Layer w0.762: U13.3 64.39,39.11 64.39,36.06 63.22,34.89 U2.10
  Bottom Layer w1.016: U13.3 77.85,29.45 v2(79.25,29.45)
  Bottom Layer w1.524: U8.3 85.87,55.76 73.04,55.76 71.37,54.09 ; 71.37,53.84 71.37,54.09 ; 71.37,54.09 71.37,58.42 71.41,58.46 71.41,59.96 70.35,61.03 70.28,61.03 舵机.2 ; 71.37,54.09 71.25,54.09 68.83,51.68 U13.3 ; 舵机2.2 64.64,61.71 66.04,60.31 66.04,57.14 69.72,53.46
(no net):
  vias: v1(2.3,5.83) v1(2.79,77.46) v1(93.09,3.04) v1(97.4,77.4)
A00: length 9.8
  Top Layer w0.254: CN9.2 1.78,70.6 3.05,71.87 6.14,71.87 U1.3
A01: length 9.8
  Top Layer w0.254: CN9.3 2.79,69.2 6.01,69.2 U1.5
A02: length 8.3
  Top Layer w0.254: CN11.10 51.8,56.25 46.31,56.25 U1.61
A07: length 23.9
  Top Layer w0.254: H1.5 61.34,48.12 58.67,48.12 57.4,46.85 57.4,41.77 55.88,40.25 CN12.16 53.97,38.98 49.15,38.98 48.35,39.78 U1.50
A08: length 73.5
  Top Layer w0.254: CN9.4 1.65,65.65 2.79,66.79 6.14,66.79 U1.7 ; H1.7 62.99,52.31 56.9,52.31 56.2,51.62 48.43,51.62 47.98,51.17 44.73,51.17 42.14,53.76 37.67,53.76 v2(20.45,70.98)
  Bottom Layer w0.254: U1.7 9.99,70.18 11.3,71.49 13.08,71.49 13.59,70.98 v2(20.45,70.98)
A09: length 9.8
  Top Layer w0.254: CN9.5 3.05,64.38 6.26,64.38 U1.9
A10: length 9.7
  Bottom Layer w0.254: U1.12 10.84,63.87 7.75,63.87 CN10.6
A11: length 9.7
  Bottom Layer w0.254: U1.14 10.71,61.2 8.13,61.2 4.83,57.9 CN10.7
A12: length 68.6
  Top Layer w0.254: CN9.15 2.79,38.72 6.01,38.72 U1.29
  Bottom Layer w0.254: H1.1 63.5,45.96 60.52,48.95 53.01,48.95 52.99,48.97 50.12,48.97 49.92,48.76 43.69,48.76 38.35,43.42 12.83,43.42 12.82,43.42 11.58,43.42 10.4,42.24 U1.29
A13: length 45.8
  Top Layer w0.254: U1.30 12.31,42.48 13.79,42.48 14.35,43.04 v2(14.35,46.85) ; v2(20.07,57.78) 20.07,69.84 U7.1
  Bottom Layer w0.254: v2(14.35,46.85) 20.07,52.57 v2(20.07,57.78) ; U1.30 10.84,41.01 8.25,41.01 4.83,37.58 CN10.15
A14: length 28.1
  Top Layer w0.254: H2.7 58.17,66.92 54.86,66.92 53.61,65.67 CN11.6 51.8,66.41 46.31,66.41 U1.69
A15: length 42.1
  Top Layer w0.254: U1.70 48.22,65.18 48.9,64.51 54.1,64.51 CN12.6 ; v2(30.13,64.03) 28.42,64.03 U7.3
  Bottom Layer w0.254: v2(30.13,64.03) 31.88,65.78 41.66,65.78 43.43,64 45.59,64 46.78,65.18 U1.70
A16: length 35.6
  Top Layer w0.254: U7.5 32.34,62.64 U1.67
  Bottom Layer w0.254: U1.67 45.51,62.64 46.86,64 51.67,64 CN11.7
A17: length 36.6
  Top Layer w0.254: U7.7 24.64,72.13 33.46,63.3 43.24,63.3 43.81,63.87 46.4,63.87 U1.68 48.43,61.84 53.97,61.84 CN12.7
A18: length 8.6
  Top Layer w0.254: CN12.18 55.25,34.92 54.23,33.9 48.43,33.9 U1.46
A21: length 8.7
  Top Layer w0.254: U1.64 48.22,57.56 49.02,56.76 54.36,56.76 55.25,57.65 CN12.9
A22: length 31
  Top Layer w0.254: U7.9 31.12,68.95 46.4,68.95 U1.72 48.35,67.72 49.02,67.05 54.23,67.05 55.25,68.06 CN12.5
A23: length 8.6
  Top Layer w0.254: U1.62 48.57,54.07 53.83,54.07 CN12.10
A24: length 28.1
  Top Layer w0.254: CN12.3 55.25,73.02 54.36,72.13 49.02,72.13 48.35,72.8 U1.76 46.44,71.62 43.31,71.62 42.54,70.86 31.75,70.86 U7.11
A25: length 36.5
  Top Layer w0.254: U1.75 45.89,72.8 47.07,73.98 51.85,73.98 CN11.3 53.31,74.06 54.51,74.06 54.99,74.54 55.88,74.54 56.9,75.56 56.9,77.97 58.5,79.57 67.61,79.57 69.09,78.09 69.09,72.76 H2.3
A26: length 26.2
  Top Layer w0.254: U7.13 33.44,71.71 41.37,71.71 43.69,74.03 46.31,74.03 U1.78 47.84,75.34 48.77,74.41 54.23,74.41 55.25,75.43 CN12.2
A27: length 19.6
  Top Layer w0.254: CN11.2 51.8,76.57 46.31,76.57 U1.77 43.47,75.34 41.02,72.89 U7.15
A28: length 93.4
  Top Layer w0.254: v2(19.18,58.66) 19.05,58.79 19.05,68.28 U1.4 ; 45.47,22.6 45.4,22.66 20.26,22.66 19.62,23.29 19.62,45.01 v2(19.69,45.08)
  Bottom Layer w0.254: U1.4 10.71,73.9 8,73.9 4.7,70.6 CN10.2 ; v2(19.69,45.08) 21.72,47.11 21.72,57.39 20.45,58.66 v2(19.18,58.66)
A29: length 50.7
  Top Layer w0.254: SW3.1 15.75,6.72 14.1,8.37 14.1,35.13 U1.34
  Bottom Layer w0.254: U1.34 10.71,35.8 7.62,35.8 CN10.17
A30: length 49.7
  Top Layer w0.254: U1.53 45.38,44.86 46.61,46.09 51.8,46.09 CN11.14
  Bottom Layer w0.254: U1.53 45,44.95 42.8,44.95 40.89,43.04 40.89,7.86 40,6.97
A31: length 91.7
  Top Layer w0.254: U1.6 12.99,72.72 17.7,68.01 17.7,22.29 19.94,20.06 45.47,20.06
  Bottom Layer w0.254: CN10.3 4.83,68.06 8.31,71.54 10.34,71.54 11.52,72.72 U1.6
AIN1: length 24.2
  Top Layer w0.254: U2.5 85.32,34.89 93.6,43.17 93.6,47.99 R5.2
AIN2: length 24.6
  Top Layer w0.254: v2(84.64,36.49) 85.78,36.49 92.84,43.55 92.84,47.36 91.15,49.05 R6.2
  Bottom Layer w0.254: U2.4 82.91,32.12 84.2,32.12 84.64,32.56 v2(84.64,36.49)
AOUT1: length 34.3
  Bottom Layer w1.524: U2.13 59.94,24.74 59.94,22.09 62.56,19.47 62.56,16.93 62.61,16.88 62.61,9.77 70.99,1.39 CN1.1
AOUT2: length 41.5
  Bottom Layer w1.524: CN1.6 86.11,1.54 86.11,15.23 83.95,17.39 79.12,17.39 71.78,24.73 U2.14
B00: length 25.6
  Top Layer w0.254: H1.3 62.87,47.11 59.31,47.11 58.29,46.09 v2(58.29,41.9) ; U1.51 46.31,43.55 51.8,43.55 CN11.15
  Bottom Layer w0.254: CN11.15 53.86,44.12 55.67,44.12 57.89,41.9 v2(58.29,41.9)
B01: length 55.3
  Top Layer w0.254: U1.52 47.97,42.32 48.77,41.52 54.1,41.52 55.25,42.66 CN12.15
  Bottom Layer w0.254: U1.52 46.78,42.32 45.59,41.14 43.69,41.14 42.04,39.49 42.04,5.83 INT.2
B02: length 77.4
  Top Layer w0.254: CN9.8 2.92,56.63 6.14,56.63 U1.15 10.71,61.2 15.88,61.2 16.76,60.31 v2(16.76,7.74)
  Bottom Layer w0.254: 10.03,7.23 10.54,7.74 v2(16.76,7.74)
B03: length 74.5
  Top Layer w0.254: CN9.9 3.05,54.22 6.26,54.22 U1.17 9.87,57.48 11.05,58.66 14.99,58.66 15.49,58.16 v2(15.49,8.75)
  Bottom Layer w0.254: 7.49,7.23 9.02,8.75 v2(15.49,8.75)
B04: length 70.5
  Bottom Layer w0.254: CN10.4 4.83,65.52 8.25,68.95 10.84,68.95 U1.8 14.82,67.43 40.58,67.43 44.65,71.49 51.44,71.49 51.94,72 55.88,72 56.39,72.51 56.39,74.03 56.77,74.41 67.44,74.41 67.82,74.03
B05: length 67.2
  Bottom Layer w0.254: H2.1 67.56,69.2 58.04,69.2 55.88,67.05 51.56,67.05 50.93,66.41 42.8,66.41 42.54,66.67 13.04,66.67 U1.10 10.71,66.28 8.13,66.28 4.83,62.98 CN10.5
B06: length 9.9
  Top Layer w0.254: CN9.13 1.65,42.79 2.79,43.93 6.14,43.93 U1.25
B07: length 9.7
  Bottom Layer w0.254: U1.26 10.89,46.14 8.18,46.14 4.7,42.66 CN10.13
B08: length 9.8
  Top Layer w0.254: CN9.14 2.92,41.39 6.14,41.39 U1.27
B09: length 9.7
  Bottom Layer w0.254: CN10.14 7.75,43.55 10.84,43.55 U1.28
B10: length 8.3
  Top Layer w0.254: U1.49 46.31,41.01 51.8,41.01 CN11.16
B11: length 8.3
  Top Layer w0.254: U1.47 46.31,38.47 51.8,38.47 CN11.17
B12: length 9.7
  Bottom Layer w0.254: CN10.8 4.83,55.36 8.13,58.66 10.71,58.66 U1.16
B13: length 119.2
  Top Layer w0.254: 78.74,7.99 75.95,10.78 58.8,10.78 54.48,15.1 54.48,23.48 53.47,24.5 21.46,24.5 20.7,25.26 v2(20.7,44.19)
  Bottom Layer w0.254: CN10.9 4.83,52.82 8.25,56.25 10.84,56.25 U1.18 12.41,57.14 13.21,57.14 13.72,56.63 13.72,45.84 15.37,44.19 v2(20.7,44.19)
B14: length 59.9
  Top Layer w0.254: U1.48 48.09,37.24 48.9,36.44 54.48,36.44 55.25,37.2 CN12.17 57.91,35.04 57.91,16.25 59.94,14.21 78.1,14.21 v2(78.61,13.71)
  Bottom Layer w0.254: v2(78.61,13.71) 81.28,11.04 81.28,7.99
B15: length 145.5
  Top Layer w0.254: 92.33,9.77 92.71,9.77 93.6,10.66 93.6,13.58 93.34,13.83 91.31,13.83 90.42,12.94 59.44,12.94 56.39,15.99 56.39,25.77 54.61,27.55 44.2,27.55 42.16,29.58 v2(42.16,52.44) ; CN9.6 1.65,60.57 2.79,61.71 6.14,61.71 U1.11
  Bottom Layer w0.254: v2(42.16,52.44) 42.16,60.7 40.77,62.09 30.35,62.09 27.62,64.82 14.41,64.82 12.95,66.28 11.43,66.28 10.25,65.1 U1.11
B16: length 138.9
  Top Layer w0.254: U1.13 6.2,59.23 2.98,59.23 CN9.7 ; v2(41.15,52.57) 41.15,29.33 43.69,26.79 54.1,26.79 55.63,25.26 55.63,15.48 59.18,11.93 91.95,11.93 92.33,12.31
  Bottom Layer w0.254: U1.13 10.25,62.56 11.49,63.81 27.62,63.81 30.1,61.33 40.51,61.33 41.15,60.7 v2(41.15,52.57)
B17: length 8.2
  Top Layer w0.254: CN11.8 51.85,61.28 46.56,61.28 45.38,60.1 U1.65
B18: length 8.6
  Top Layer w0.254: U1.66 47.84,60.1 48.77,59.17 53.85,59.17 CN12.8
B19: length 8.2
  Top Layer w0.254: CN11.9 51.85,58.74 46.43,58.74 45.25,57.56 U1.63
B20: length 8.3
  Bottom Layer w0.254: U1.71 46.31,68.95 51.8,68.95 CN11.5
B21: length 8.3
  Top Layer w0.254: CN11.13 51.82,48.61 46.29,48.61 U1.55
B22: length 8.5
  Top Layer w0.254: U1.56 47.71,47.4 48.51,46.6 53.97,46.6 CN12.13
B23: length 10
  Top Layer w0.254: CN9.16 1.65,35.3 2.54,36.19 6.01,36.19 U1.31
B24: length 8.7
  Top Layer w0.254: CN12.4 55.25,70.35 54.36,69.46 48.9,69.46 48.09,70.26 U1.74
B25: length 8.3
  Top Layer w0.254: CN11.4 51.81,71.48 47.1,71.48 45.89,70.26 U1.73
B26: length 9.7
  Bottom Layer w0.254: CN10.16 7.75,38.47 10.84,38.47 U1.32
B27: length 9.8
  Top Layer w0.254: U1.33 6.14,33.77 2.92,33.77 CN9.17
BIN1: length 42.7
  Top Layer w0.254: R7.2 91.34,46.58 92.07,45.84 92.07,43.81 86.74,38.47 83.11,38.47 83.1,38.47 82.24,38.47 82.24,38.47 67.69,38.47 64.77,35.55 64.77,30.6 64.01,29.83 62.5,29.83 U2.12
BIN2: length 37.6
  Top Layer w0.254: R8.2 90.06,43.19 85.81,38.93 67.01,38.93 64.13,36.06 61.34,36.06 60.83,35.55 60.83,33.26 61.74,32.35 U2.11
BOUT1: length 44.6
  Bottom Layer w1.016: U2.6 80.77,35.53 80.77,23.99 90.04,14.72 90.04,7.48 91.76,5.77 97.45,5.77 CN2.1
BOUT2: length 34.7
  Bottom Layer w1.016: CN2.6 98.65,16.75 90.68,16.75 85.6,21.83 85.6,36.89 82.67,39.82 U2.7
CHIP: length 9.7
  Bottom Layer w0.254: U1.36 10.71,33.26 8.25,33.26 4.95,29.96 CN10.18
CLK: length 9.8
  Bottom Layer w0.254: CN10.10 4.32,50.54 7.36,53.58 10.7,53.58 U1.20
DIO: length 9.8
  Top Layer w0.254: U1.19 6.26,51.68 3.05,51.68 CN9.10
DIR1: length 4.7
  Top Layer w0.254: 70.36,74.03 74.24,74.03 R10.1
DIR1_O: length 26.1
  Top Layer w0.254: R14.2 91.25,73.14 93.09,73.14 93.98,72.25 93.98,66.28 93.47,65.78 82.93,65.78 80.52,63.36 U6.6
DIR2: length 4.5
  Top Layer w0.254: H2.2 74.69,68.95 R12.1
DIR2_O: length 28.8
  Bottom Layer w0.254: U8.6 80.01,58.28 81.91,60.19 93.73,60.19 94.62,61.08 94.62,68.19 93.33,69.48 v2(90.03,69.48)
OUT1: length 3.4
  Bottom Layer w0.254: U7.2 CN3.1
OUT2: length 3.4
  Bottom Layer w0.254: U7.4 CN3.2
OUT3: length 3.4
  Bottom Layer w0.254: U7.6 CN3.3
OUT4: length 3.4
  Bottom Layer w0.254: U7.8 CN3.4
OUT5: length 3.4
  Bottom Layer w0.254: U7.10 CN3.5
OUT6: length 3.4
  Bottom Layer w0.254: U7.12 CN3.6
OUT7: length 3.4
  Bottom Layer w0.254: U7.14 CN3.7
OUT8: length 3.4
  Bottom Layer w0.254: U7.16 CN3.8
PIN1: length 4.7
  Bottom Layer w0.254: SW1.1 25.12,4.54 SW3.2
PIN2: length 2.8
  Top Layer w0.254: 37.47,6.97 36.24,5.75 36.24,4.66
PUL1: length 4.8
  Top Layer w0.254: H2.8 74.02,76.57 R9.1
PUL1_O: length 42.3
  Top Layer w0.254: R13.2 92.73,76.68 95,74.41 95,66.41 93.85,65.27 84.33,65.27 U6.5 79.5,60.44 71.37,60.44 70.14,59.21 舵机.3
PUL2: length 4.6
  Top Layer w0.254: R11.1 74.47,71.49 H2.4
PUL2_O: length 52.7
  Top Layer w0.254: 舵机2.3 63.56,59.02 63.56,57.33 64.64,56.25 81.28,56.25 U8.5
  Bottom Layer w0.254: U8.5 82.8,57.78 82.8,59.17 83.19,59.55 94.36,59.55 95.5,60.7 95.5,70.6 94.44,71.67 v2(90.15,71.67)
PWM1: length 4.9
  Top Layer w0.254: H1.8 66.42,52.82 67.84,51.4 R1.1
PWM2: length 4.8
  Top Layer w0.254: H1.6 67.27,49.05 R2.1
PWM3: length 4.8
  Top Layer w0.254: H1.4 67.18,46.6 70.23,46.6 R3.1
PWM4: length 4.6
  Top Layer w0.254: H1.2 66.89,44.35 R4.1
RST: length 8.3
  Top Layer w0.254: CN11.18 51.8,35.93 46.31,35.93 U1.45
VM: length 146.4
  Top Layer w1.524: U3.1 U3.2 97.23,65.98 94.49,63.24 92.71,63.24 U6.1 ; U2.9 62.39,37.52 60.77,37.52 59.44,36.19 59.44,24.88 61.85,22.47 U13.1 U13.1 68.83,20.94 70.99,18.79 88.9,18.79 U12.1 88.75,21.2 U2.2
  Bottom Layer w1.524: 92.71,56.12 U8.1 ; 92.71,56.12 92.71,43.3 88.26,38.85 88.26,24.25 U12.1 96.27,26.15 96.27,28.69 97.79,30.22 +12UP.2 ; 92.71,56.12 94.79,58.19 97.93,58.19 98.91,59.18 98.91,62.32 98.93,62.34 98.93,68.71 U3.2
$1N279: length 5.7
  Top Layer w0.254: U4.3 74.42,50.16 73.17,51.4 R1.2
$1N280: length 5.3
  Top Layer w0.254: R2.2 77.38,49.05 U4.4
$1N281: length 5.6
  Top Layer w0.254: U4.5 73.28,47.61 72.37,46.7 R3.2
$1N282: length 6
  Top Layer w0.254: R4.2 74.33,46.34 U4.6
$1N288: length 5.1
  Top Layer w0.254: U4.14 86.69,50.16 R5.1
$1N289: length 4.6
  Top Layer w0.254: R6.1 87.9,48.89 U4.13
$1N290: length 5
  Top Layer w0.254: U4.12 85.98,47.61 87.02,46.58 R7.1
$1N291: length 5.7
  Top Layer w0.254: U4.11 84.46,46.34 86.16,44.64 87.81,44.64 88.06,44.39 R8.1
$1N324: length 13.3
  Top Layer w1.524: DC2.1 88.9,32.52 88.9,28.31 U12.2
$1N338: length 3.2
  Top Layer w0.254: U5.11 85.96,70.04 86.28,70.04 86.59,69.73 R16.1
$1N339: length 2.2
  Top Layer w0.254: 88.03,72.05 87.95,72.13 85.83,72.13
$1N340: length 3.2
  Top Layer w0.254: U5.13 86.93,73.27 R14.1
$1N341: length 3.6
  Top Layer w0.254: R13.1 85.89,74.54 U5.14
$1N347: length 3.3
  Top Layer w0.254: U5.6 78.69,70.73 R12.2
$1N348: length 2.9
  Top Layer w0.254: U5.5 78.23,72 77.39,71.16 R11.2
$1N349: length 2.6
  Top Layer w0.254: U5.4 79.12,73.47 R10.2
$1N350: length 3
  Top Layer w0.254: U5.3 79.18,74.54 77.92,75.79 R9.2
$1N570: length 4
  Top Layer w0.254: 10.03,4.69 7.75,2.4 OLED1.3
$1N571: length 4.2
  Bottom Layer w0.254: 7.49,4.69 10.29,1.9 OLED1.4
$1N572: length 4.1
  Top Layer w0.254: 78.74,5.45 78.74,1.41 CN1.3
$1N573: length 4.1
  Top Layer w0.254: CN1.4 81.28,1.41 81.28,5.45
$1N574: length 4.1
  Top Layer w0.254: CN2.3 98.44,9.77 94.87,9.77
$1N575: length 4.1
  Top Layer w0.254: 94.87,12.31 98.41,12.31 CN2.4
$1N583: length 8.2
  Bottom Layer w0.254: 48.01,20.06 49.28,18.79 49.28,16.25 51.56,13.96 P1.3
$1N584: length 13.5
  Top Layer w0.254: P1.4 51.18,11.42 50.42,12.18 50.42,20.18 48.01,22.6
$1N587: length 3.2
  Top Layer w0.254: P1.8 52.07,1.39 INT.1

## Copper pours and planes (outline as drawn; the poured copper is in the pictures)
GND on Top Layer: 77.98,67.55 77.85,67.43 61.98,67.43 61.98,56.25 61.59,55.87 62.34,55.12 75.78,55.12 75.78,42.33 75.73,42.28 59.31,42.28 59.18,42.15 59.18,0.75 59.06,0.62 59.06,-0.14 59.31,-0.39 1.4,-0.39 -0.64,1.64 -0.64,77.49 1.44,79.56 1.41,79.6 1.41,82.67 76.57,82.67 77.98,81.27
GND on Top Layer: 67.82,55.87 78.66,55.87 78.66,42.49 67.82,42.49
GND on Top Layer: 76.84,79.75 80.26,79.75 80.26,67.3 76.84,67.3
GND on Top Layer: 59.18,9.72 88.65,9.72 88.65,15.1 91.06,17.52 102.49,17.52 102.62,17.64 102.62,1.13 100.84,-0.65 59.34,-0.65 59.02,-0.33 59.02,9.56
GND on Bottom Layer: 77.85,67.3 77.98,67.17 62.87,67.17 60.83,65.14 60.58,65.14 60.58,55.65 60.44,55.51 61.03,54.91 75.73,54.91 75.73,43.08 60.11,43.08 58.29,41.27 58.29,16.63 57.91,16.25 59.37,14.79 94.38,14.79 97.28,17.69 97.28,18.31 101.19,18.31 101.22,18.28 101.22,0.9 98.91,-1.41 0.38,-1.41 -1.4,0.37 -1.4,83.43 -0.76,84.06 75.56,84.06 77.85,81.78
GND on Bottom Layer: 69.47,54.47 78.41,54.47 78.41,42.79 69.47,42.79
GND on Bottom Layer: 76.21,79.82 80.26,79.82 80.26,67.03 76.21,67.03
GND on Bottom Layer: 68.63,54.55 78.44,54.55 78.44,42.79 68.63,42.79
GND_MOTOR on Top Layer: 82.35,55.06 92.58,55.06 92.58,42.53 82.35,42.53
GND_MOTOR on Top Layer: 84.2,79.87 88.35,79.87 88.35,66.99 84.2,66.99
GND_MOTOR on Top Layer: 86.74,80.89 87,80.64 103,80.64 103,22.72 99.82,19.55 94.36,19.55 92.71,17.9 61.62,17.9 60.45,19.07 60.45,42.03 61.09,42.66 84.96,42.66 84.84,42.79 84.84,55.36 84.33,55.87 61.85,55.87 62.3,56.33 62.3,65.71 62.88,66.28 86.74,66.28
GND_MOTOR on Bottom Layer: 84.07,79.75 88.77,79.75 88.77,66.54 84.07,66.54
GND_MOTOR on Bottom Layer: 103,80.64 103,22.72 99.69,19.42 99.53,19.59 94.53,19.59 92.81,17.87 61.62,17.87 60.45,19.04 60.45,42.03 61.04,42.62 61.04,42.66 84.84,42.66 84.84,55.49 84.33,56 84.2,55.87 61.85,55.87 62.23,56.25 62.23,65.64 62.88,66.28 86.74,66.28 86.74,80.76 86.87,80.64
GND_MOTOR on Bottom Layer: 82.68,54.6 87.76,54.6 87.76,42.66 82.68,42.66

Small or netless copper shapes (teardrops, artwork), in the pictures only: 270 on Top Layer, 145 on Bottom Layer

## Text on the board
Top Silkscreen Layer: OFF | ON | + / - | 步进2 | 步进1 | M0板子
